# Altium project S7CAS-PLEIADES-CARTE-MERE_P01.PrjPcb (part 1 of 4)
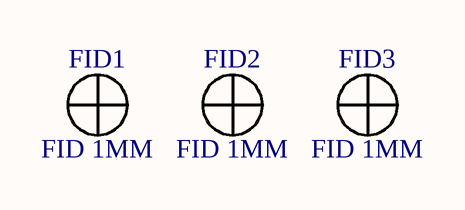
[diagram p0: S7CAS-PLEIADES-CARTE-MERE_P01_TITLE.SchDoc]
Project_Revision: 1.00; Project_Name: S7CAS-PLEIADES-CARTE-MERE; Project_Group: 01; Project_Global: Pleiades; Project_Designer3: Rejean Fontaine; Project_Designer2: Mathys Plante (PLAM1001); Project_Designer1: Mathieu Desautels (DESM1210); Project_Date: 13/01/2026
17 sheets, 430 parts. Net scope: flat (ports and power ports of the same name join across sheets).
Board file: S7CAS-PLEIADES-CARTE-MERE_P01.PcbDoc
Sheets:
  S7CAS-PLEIADES-CARTE-MERE_P01_TITLE.SchDoc
  S7CAS-PLEIADES-CARTE-MERE_P01_POWER.SchDoc
  S7CAS-PLEIADES-CARTE-MERE_P01_ALIM.SchDoc
  S7CAS-PLEIADES-CARTE-MERE_P01_CLOCK.SchDoc
  S7CAS-PLEIADES-CARTE-MERE_P01_ETHERNET.SchDoc
  S7CAS-PLEIADES-CARTE-MERE_P01_CNA.SchDoc
  S7CAS-PLEIADES-CARTE-MERE_P01_CAN.SchDoc
  S7CAS-PLEIADES-CARTE-MERE_P01_DDR3.SchDoc
  S7CAS-PLEIADES-CARTE-MERE_P01_MOTORS.SchDoc
  S7CAS-PLEIADES-CARTE-MERE_P01_IO.SchDoc
  S7CAS-PLEIADES-CARTE-MERE_P01_FPGA-BANK0.SchDoc
  S7CAS-PLEIADES-CARTE-MERE_P01_FPGA-BANK1.SchDoc
  S7CAS-PLEIADES-CARTE-MERE_P01_FPGA-BANK2.SchDoc
  S7CAS-PLEIADES-CARTE-MERE_P01_FPGA-BANK3.SchDoc
  S7CAS-PLEIADES-CARTE-MERE_P01_FPGA-BANK4.SchDoc
  S7CAS-PLEIADES-CARTE-MERE_P01_FPGA-BANK5.SchDoc
  S7CAS-PLEIADES-CARTE-MERE_P01_FPGA-ALIM.SchDoc

## Sheet S7CAS-PLEIADES-CARTE-MERE_P01_TITLE.SchDoc
size Tabloid; DocumentNumber: 1; SheetNumber: 1; SheetTotal: 17; Sheet_Name: Insert name in Document Parameters; Size: 11x17

### Parts
FID1  FID 1MM  [FID_CIRCLE_1MM]
FID2  FID 1MM  [FID_CIRCLE_1MM]
FID3  FID 1MM  [FID_CIRCLE_1MM]

### Nets

Not connected (* = marked no-connect by the designer): FID1 1 2; FID2 1 2; FID3 1 2

### Notes on the sheet
- Revision history
- Package size conversion
- Metric
- 1005
- 1608
- Imperial
- 0402
- 0603
- Revision
- 2012
- 3216
- 0805
- 1206
- 3225
- 6432
- 1210
- 2512
- Date :
- Project Title
- Global Project
- Size
- Group
- Date
- Sheet
- of
- Filename
- Designers

### Library data of the parts
FID1-FID3 = FID_CIRCLE_1MM: FID - FIDUCIAL 1MM CIRCLE DOUBLE-SIDED - 1MM; GRAMS Lib Spec: 2.8; Magnetic Material: NO; Cryo: UNKNOWN; Value: *; Tolerance: *; Voltage Rating: *; Current Rating: *; Power Max: *; HelpURL: https://www.pcb-3d.com/wordpress/wp-content/uploads/ipc-sm-782a_amendment_1_and_2.pdf; CreatedBy/Date: Jonathan Bouchard 2018-07-23; VerifiedBy: Caroline Paulin - 25 juillet 2018; Temperature: *; Package: 1MM CIRCLE; Manufacturer #1: *; Manufacturer #2: *; Part Number #2: *; Part Number #1: *; Polarized: *; Supplier 1: *; Supplier Part Number 1: *

## Sheet S7CAS-PLEIADES-CARTE-MERE_P01_POWER.SchDoc
size Tabloid; DocumentNumber: 2; SheetNumber: 2; SheetTotal: 17; Sheet_Name: POWER TREE; Size: 11x17

### Notes on the sheet
- Sheet Name
- Project Title
- Global Project
- Size
- Group
- Revision
- Date
- Sheet
- of
- Filename
- Designers
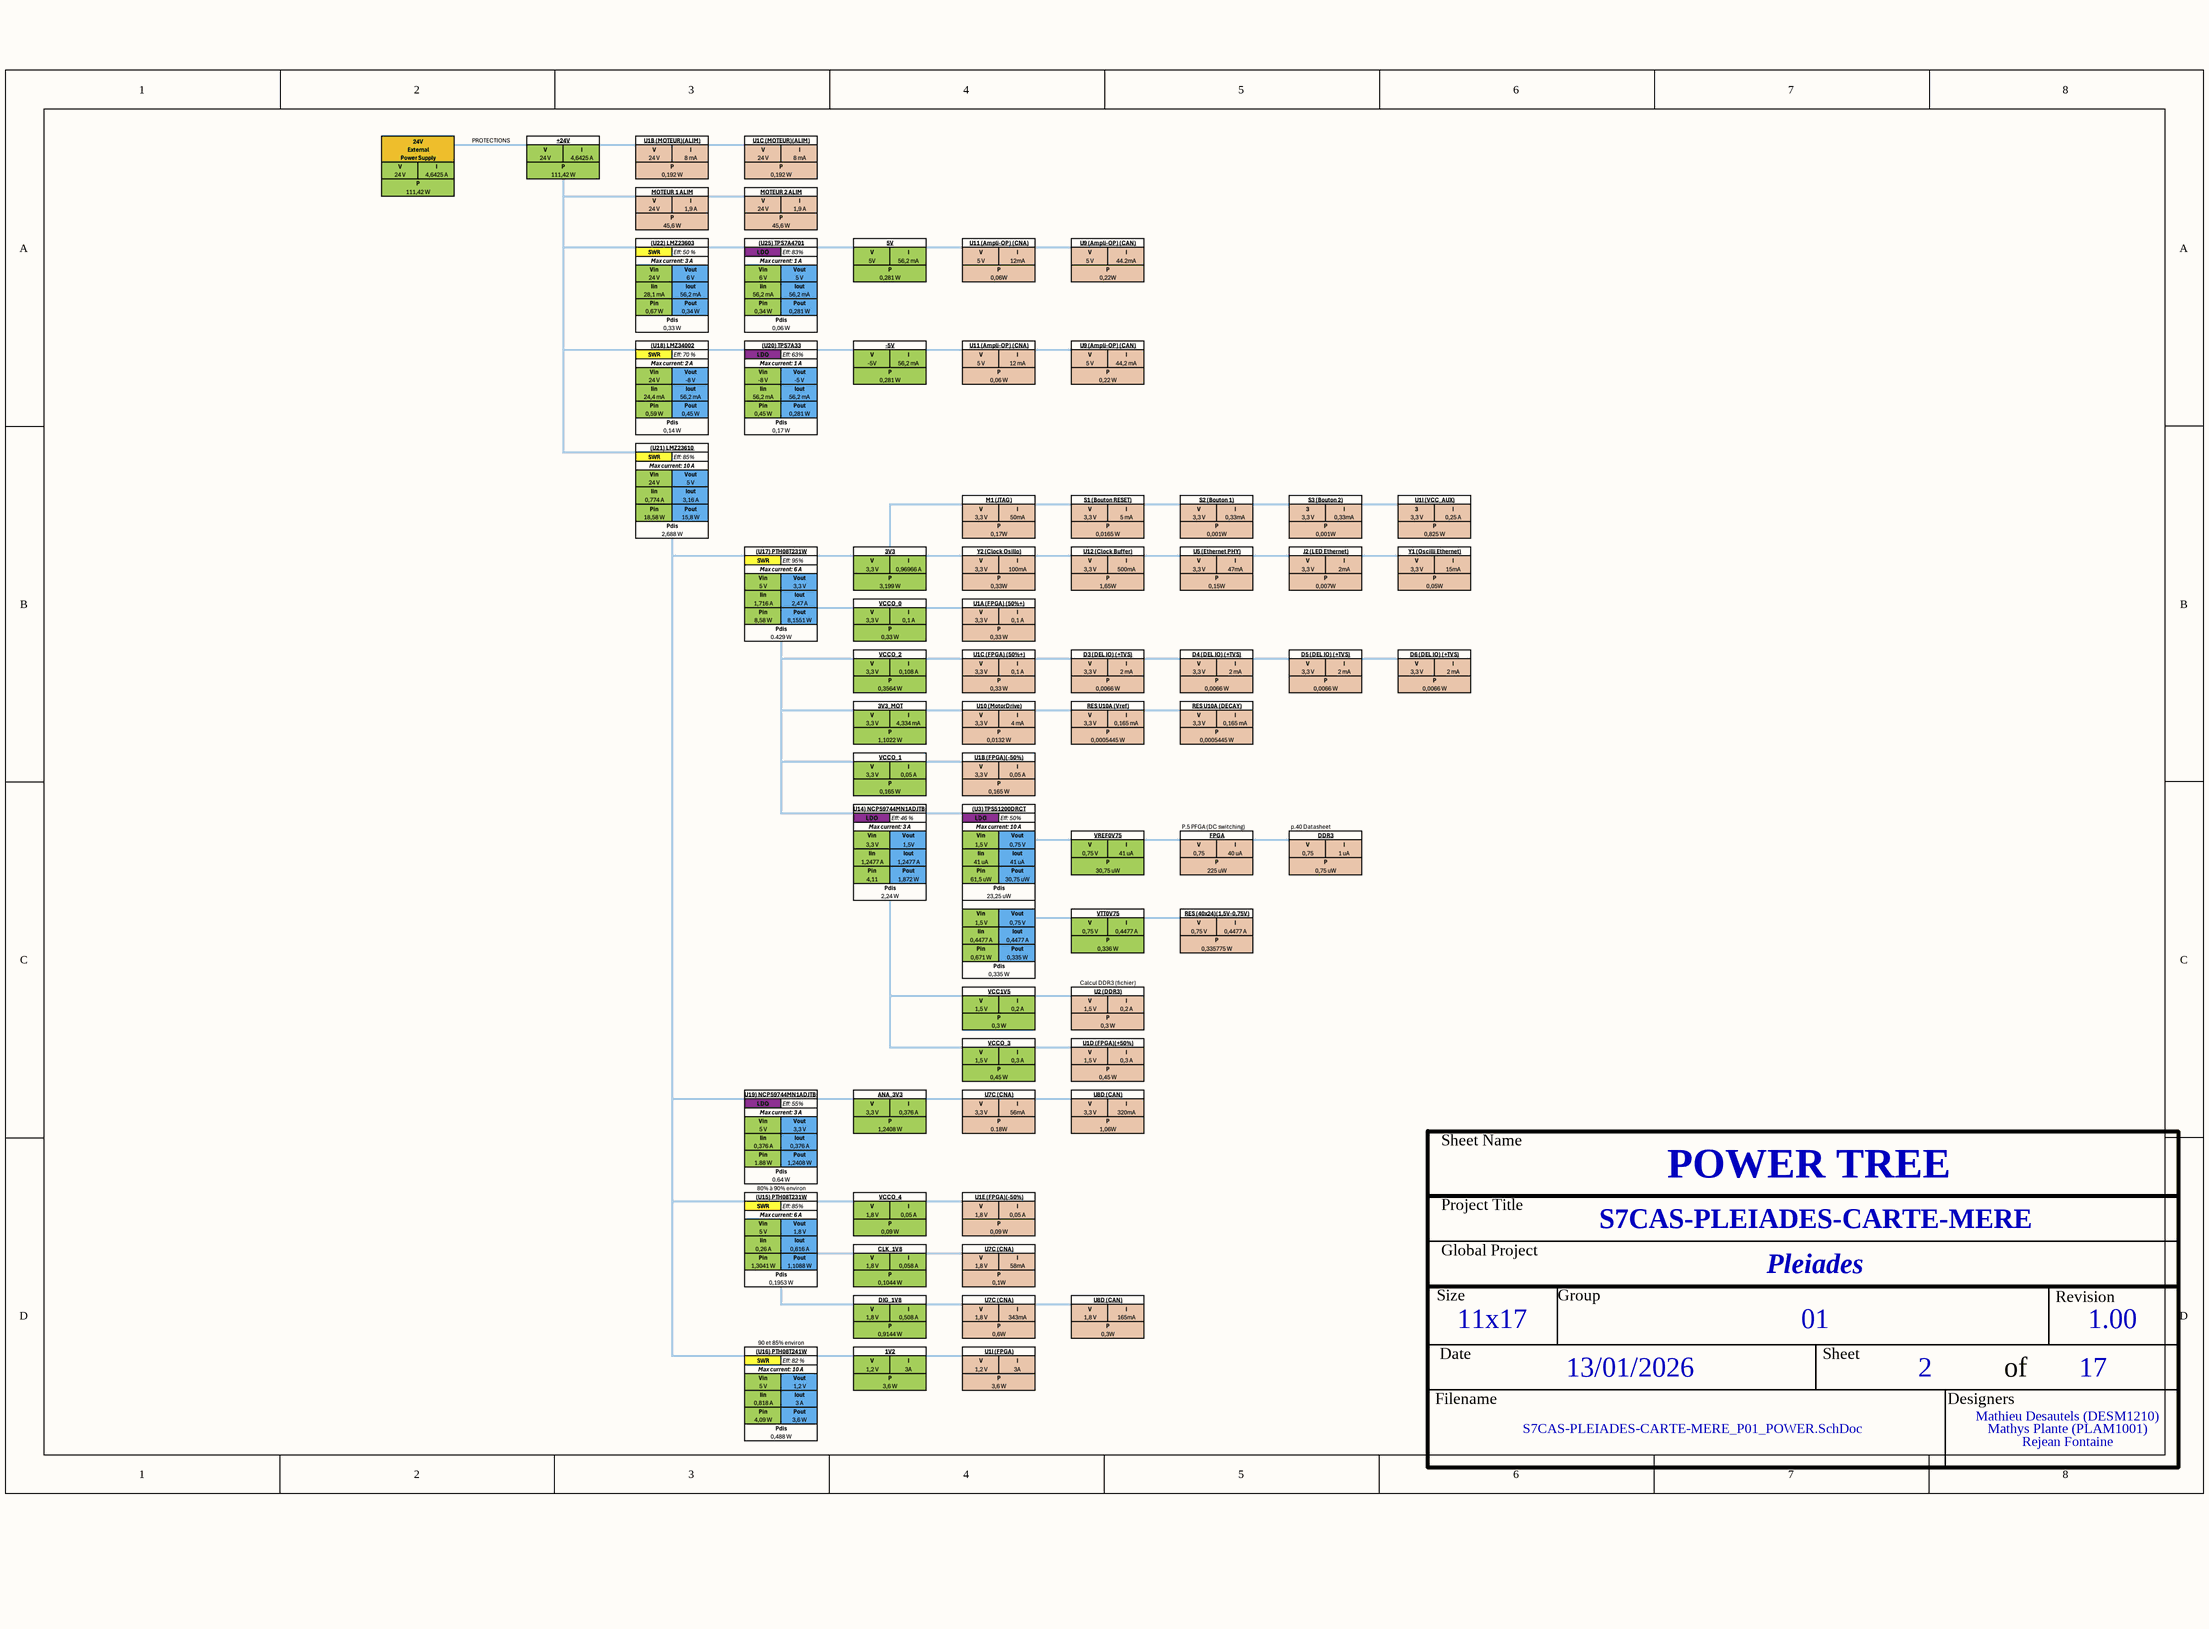
[diagram p1: S7CAS-PLEIADES-CARTE-MERE_P01_POWER.SchDoc]

## Sheet S7CAS-PLEIADES-CARTE-MERE_P01_ALIM.SchDoc
size Tabloid; DocumentNumber: 3; SheetNumber: 3; SheetTotal: 17; Sheet_Name: ALIM; Size: 11x17
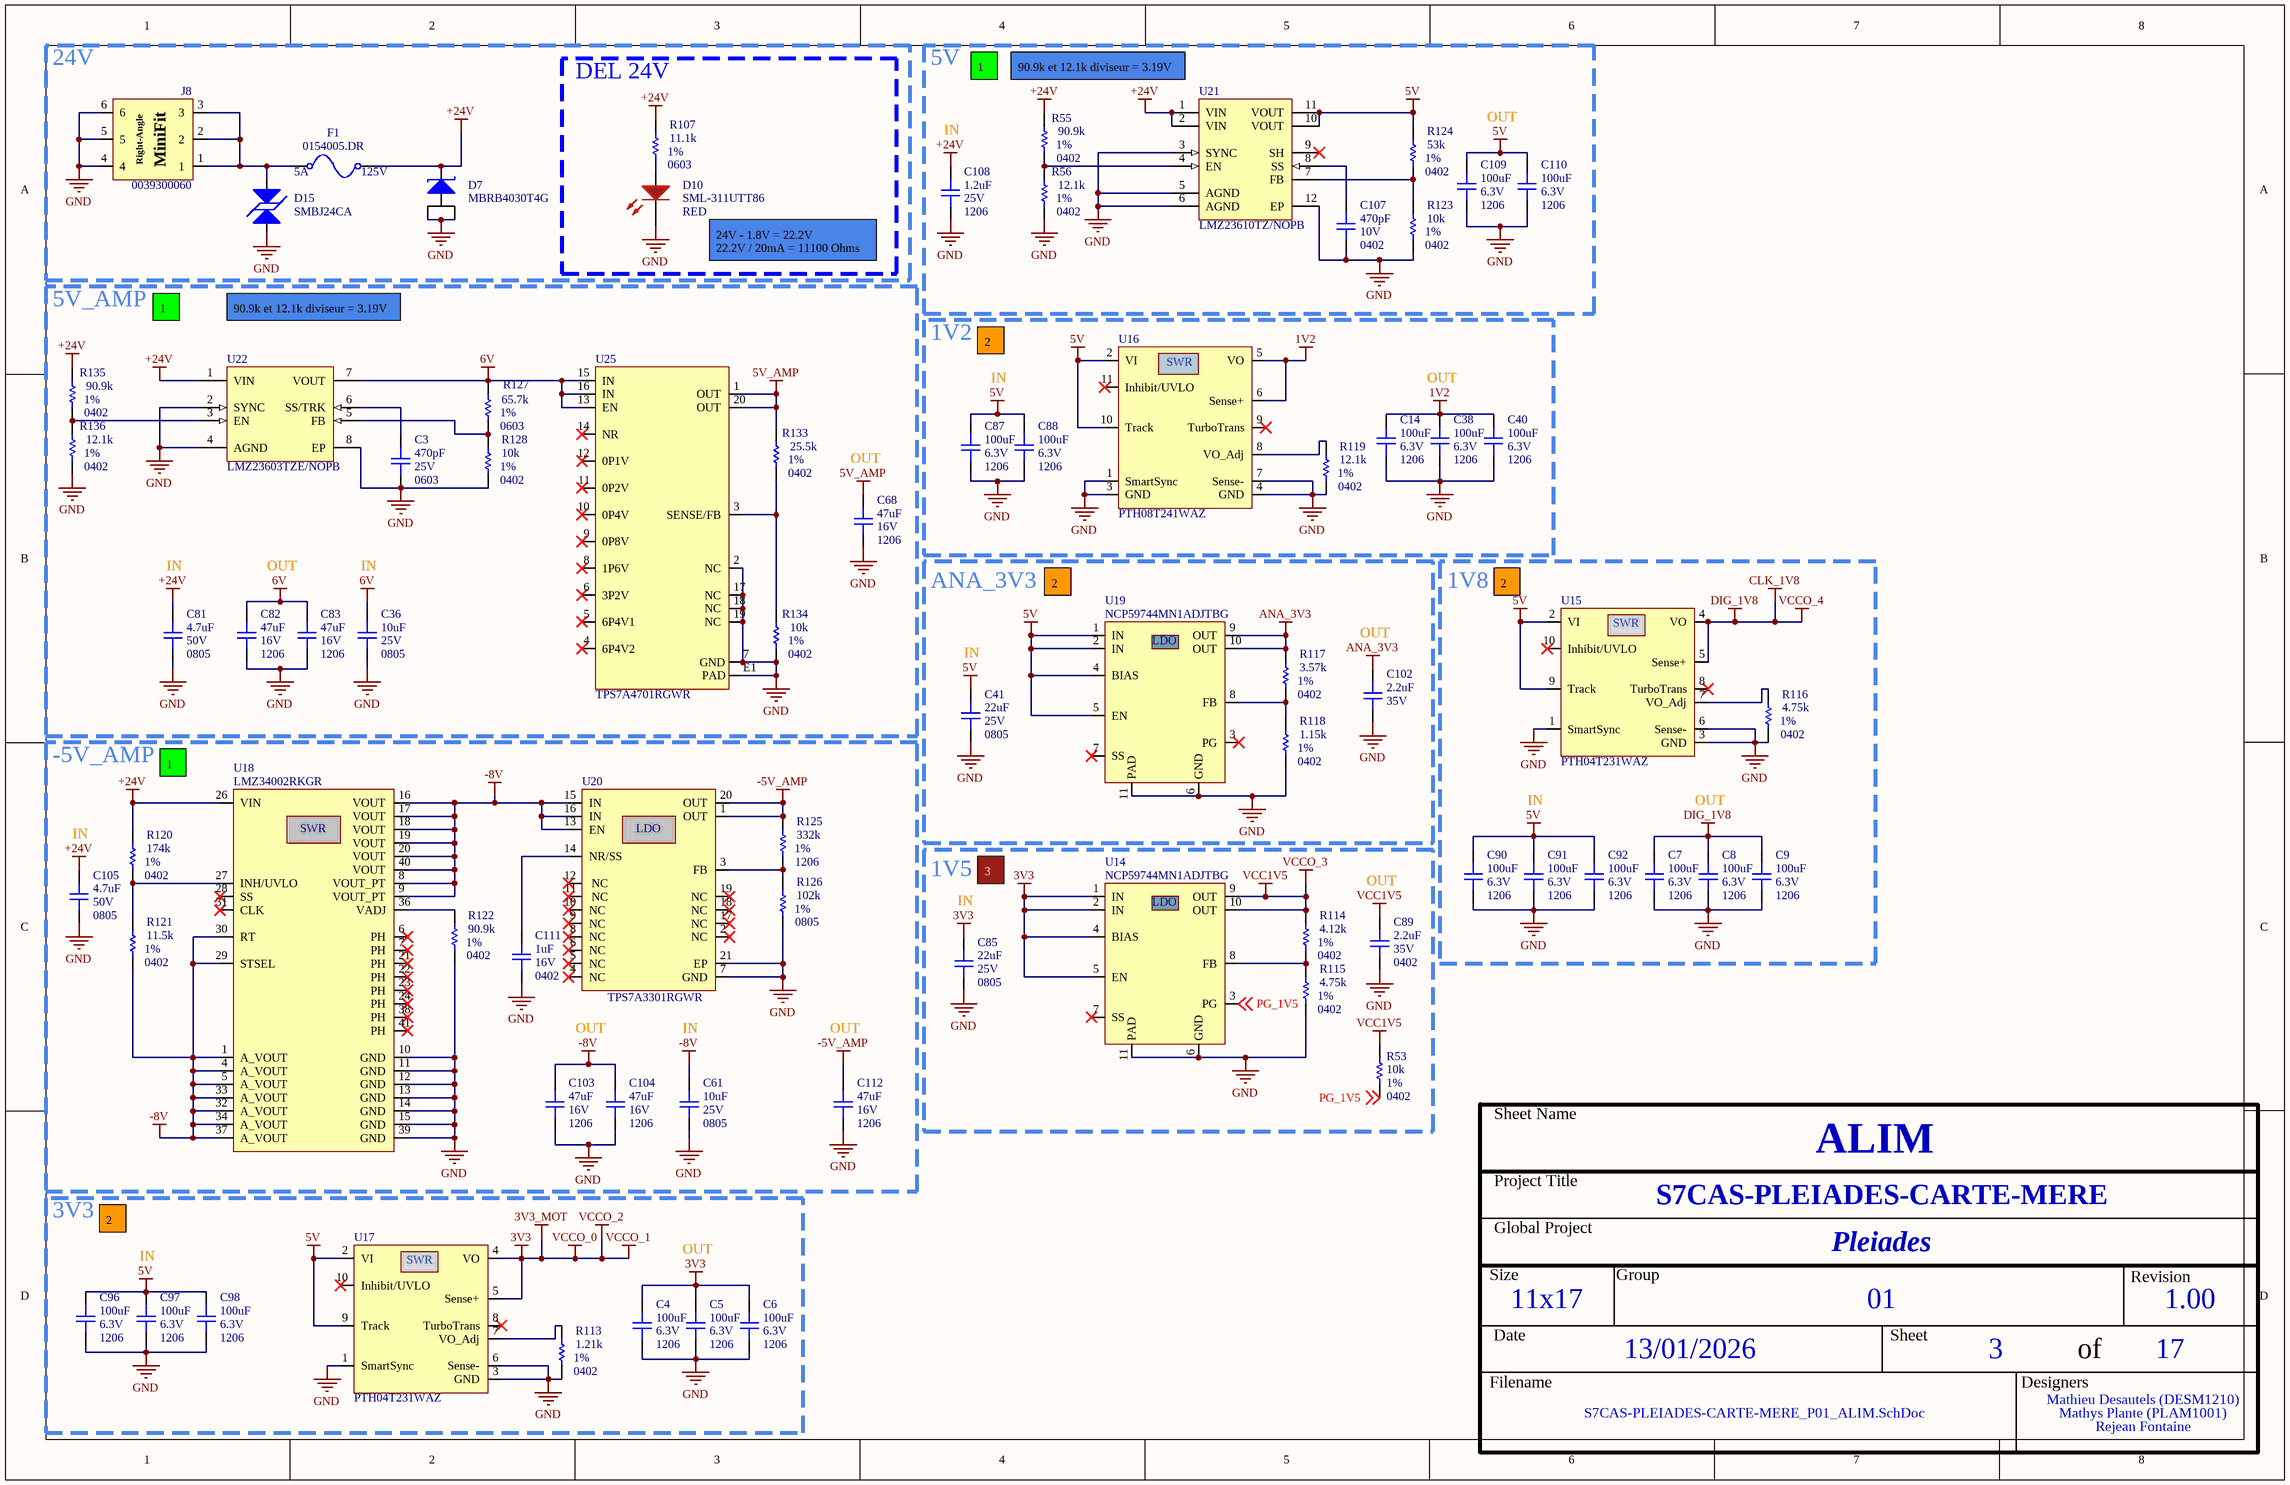
[diagram p2: S7CAS-PLEIADES-CARTE-MERE_P01_ALIM.SchDoc]

### Parts
C3  value 470pF  Voltage: 25V  Package: 0603  [CAP_0603]  (hidden comment: CAP - 0603)
C4  value 100uF  Voltage: 6.3V  Package: 1206  [CAP_1206]  (hidden comment: CAP - 1206)
C5  value 100uF  Voltage: 6.3V  Package: 1206  [CAP_1206]  (hidden comment: CAP - 1206)
C6  value 100uF  Voltage: 6.3V  Package: 1206  [CAP_1206]  (hidden comment: CAP - 1206)
C7  value 100uF  Voltage: 6.3V  Package: 1206  [CAP_1206]  (hidden comment: CAP - 1206)
C8  value 100uF  Voltage: 6.3V  Package: 1206  [CAP_1206]  (hidden comment: CAP - 1206)
C9  value 100uF  Voltage: 6.3V  Package: 1206  [CAP_1206]  (hidden comment: CAP - 1206)
C14  value 100uF  Voltage: 6.3V  Package: 1206  [CAP_1206]  (hidden comment: CAP - 1206)
C36  value 10uF  Voltage: 25V  Package: 0805  [CAP_0805]  (hidden comment: CAP - 0805)
C38  value 100uF  Voltage: 6.3V  Package: 1206  [CAP_1206]  (hidden comment: CAP - 1206)
C40  value 100uF  Voltage: 6.3V  Package: 1206  [CAP_1206]  (hidden comment: CAP - 1206)
C41  value 22uF  Voltage: 25V  Package: 0805  [CAP_0805]  (hidden comment: CAP - 0805)
C61  value 10uF  Voltage: 25V  Package: 0805  [CAP_0805]  (hidden comment: CAP - 0805)
C68  value 47uF  Voltage: 16V  Package: 1206  [CAP_1206]  (hidden comment: CAP - 1206)
C81  value 4.7uF  Voltage: 50V  Package: 0805  [CAP_0805]  (hidden comment: CAP - 0805)
C82  value 47uF  Voltage: 16V  Package: 1206  [CAP_1206]  (hidden comment: CAP - 1206)
C83  value 47uF  Voltage: 16V  Package: 1206  [CAP_1206]  (hidden comment: CAP - 1206)
C85  value 22uF  Voltage: 25V  Package: 0805  [CAP_0805]  (hidden comment: CAP - 0805)
C87  value 100uF  Voltage: 6.3V  Package: 1206  [CAP_1206]  (hidden comment: CAP - 1206)
C88  value 100uF  Voltage: 6.3V  Package: 1206  [CAP_1206]  (hidden comment: CAP - 1206)
C89  value 2.2uF  Voltage: 35V  Package: 0402  [CAP_0402]  (hidden comment: CAP - 0402)
C90  value 100uF  Voltage: 6.3V  Package: 1206  [CAP_1206]  (hidden comment: CAP - 1206)
C91  value 100uF  Voltage: 6.3V  Package: 1206  [CAP_1206]  (hidden comment: CAP - 1206)
C92  value 100uF  Voltage: 6.3V  Package: 1206  [CAP_1206]  (hidden comment: CAP - 1206)
C96  value 100uF  Voltage: 6.3V  Package: 1206  [CAP_1206]  (hidden comment: CAP - 1206)
C97  value 100uF  Voltage: 6.3V  Package: 1206  [CAP_1206]  (hidden comment: CAP - 1206)
C98  value 100uF  Voltage: 6.3V  Package: 1206  [CAP_1206]  (hidden comment: CAP - 1206)
C102  value 2.2uF  Voltage: 35V  [CAP_0402]  (hidden comment: CAP - 0402)
C103  value 47uF  Voltage: 16V  Package: 1206  [CAP_1206]  (hidden comment: CAP - 1206)
C104  value 47uF  Voltage: 16V  Package: 1206  [CAP_1206]  (hidden comment: CAP - 1206)
C105  value 4.7uF  Voltage: 50V  Package: 0805  [CAP_0805]  (hidden comment: CAP - 0805)
C107  value 470pF  Voltage: 10V  Package: 0402  [CAP_0402]  (hidden comment: CAP - 0402)
C108  value 1.2uF  Voltage: 25V  Package: 1206  [CAP_1206]  (hidden comment: CAP - 1206)
C109  value 100uF  Voltage: 6.3V  Package: 1206  [CAP_1206]  (hidden comment: CAP - 1206)
C110  value 100uF  Voltage: 6.3V  Package: 1206  [CAP_1206]  (hidden comment: CAP - 1206)
C111  value 1uF  Voltage: 16V  Package: 0402  [CAP_0402]  (hidden comment: CAP - 0402)
C112  value 47uF  Voltage: 16V  Package: 1206  [CAP_1206]  (hidden comment: CAP - 1206)
D7  MBRB4030T4G  [DIO_SCHOTTKY_MBRB4030T4G]
D10  SML-311UTT86  value RED  [LED_0603]
D15  SMBJ24CA  [TVS_PWR_SMBJ36CA]
F1  0154005.DR  Voltage Rating: 125V  Current Rating: 5A  [FUS_0154XXX.DR]
J8  0039300060  [CON_MINIFIT_0039300060]
R53  value 10k  Package: 0402  Precision: 1%  [RES_0402]  (hidden comment: RES - 0402)
R55  value 90.9k  Package: 0402  Precision: 1%  [RES_0402]  (hidden comment: RES - 0402)
R56  value 12.1k  Package: 0402  Precision: 1%  [RES_0402]  (hidden comment: RES - 0402)
R107  value 11.1k  Package: 0603  Precision: 1%  [RES_0603]  (hidden comment: RES - 0603)
R113  value 1.21k  Package: 0402  Precision: 1%  [RES_0402]  (hidden comment: RES - 0402)
R114  value 4.12k  Package: 0402  Precision: 1%  [RES_0402]  (hidden comment: RES - 0402)
R115  value 4.75k  Package: 0402  Precision: 1%  [RES_0402]  (hidden comment: RES - 0402)
R116  value 4.75k  Package: 0402  Precision: 1%  [RES_0402]  (hidden comment: RES - 0402)
R117  value 3.57k  Package: 0402  Precision: 1%  [RES_0402]  (hidden comment: RES - 0402)
R118  value 1.15k  Package: 0402  Precision: 1%  [RES_0402]  (hidden comment: RES - 0402)
R119  value 12.1k  Package: 0402  Precision: 1%  [RES_0402]  (hidden comment: RES - 0402)
R120  value 174k  Package: 0402  Precision: 1%  [RES_0402]  (hidden comment: RES - 0402)
R121  value 11.5k  Package: 0402  Precision: 1%  [RES_0402]  (hidden comment: RES - 0402)
R122  value 90.9k  Package: 0402  Precision: 1%  [RES_0402]  (hidden comment: RES - 0402)
R123  value 10k  Package: 0402  Precision: 1%  [RES_0402]  (hidden comment: RES - 0402)
R124  value 53k  Package: 0402  Precision: 1%  [RES_0402]  (hidden comment: RES - 0402)
R125  value 332k  Package: 1206  Precision: 1%  [RES_1206]  (hidden comment: RES - 1206)
R126  value 102k  Package: 0805  Precision: 1%  [RES_0805]  (hidden comment: RES - 0805)
R127  value 65.7k  Package: 0603  Precision: 1%  [RES_0603]  (hidden comment: RES - 0603)
R128  value 10k  Package: 0402  Precision: 1%  [RES_0402]  (hidden comment: RES - 0402)
R133  value 25.5k  Package: 0402  Precision: 1%  [RES_0402]  (hidden comment: RES - 0402)
R134  value 10k  Package: 0402  Precision: 1%  [RES_0402]  (hidden comment: RES - 0402)
R135  value 90.9k  Package: 0402  Precision: 1%  [RES_0402]  (hidden comment: RES - 0402)
R136  value 12.1k  Package: 0402  Precision: 1%  [RES_0402]  (hidden comment: RES - 0402)
U14  NCP59744MN1ADJTBG  [REG_LDO_NCP59744MN1ADJTBG]
U15  PTH04T231WAZ  [REG_SWR_PTH04T231WAZ]
U16  PTH08T241WAZ  [REG_SWR_PTH08T241WAZ]
U17  PTH04T231WAZ  [REG_SWR_PTH04T231WAZ]
U18  LMZ34002RKGR  [REG_SWR_LMZ34002RKGR]
U19  NCP59744MN1ADJTBG  [REG_LDO_NCP59744MN1ADJTBG]
U20  TPS7A3301RGWR  [REG_LDO_TPS7A3301RGWR]
U21  LMZ23610TZ/NOPB  [NDY0011A_M]
U22  LMZ23603TZE/NOPB  [NDW0007A_V]
U25  TPS7A4701RGWR  [REG_TPS7A4701RGWR]

### Blocks framed on the sheet
24V: D7 D15 F1 J8
5V: C107-C110 R55 R56 R123 R124 U21
DEL 24V: D10 R107
5V_AMP: C3 C36 C68 C81-C83 R127 R128 R133-R136 U22 U25
1V2: C14 C38 C40 C87 C88 R119 U16
ANA_3V3: C41 C102 R117 R118 U19
1V8: C7-C9 C90-C92 R116 U15
-5V_AMP: C61 C103-C105 C111 C112 R120-R122 R125 R126 U18 U20
1V5: C85 C89 R53 R114 R115 U14
3V3: C4-C6 C96-C98 R113 U17

### Nets
1V2: C14.2 C38.2 C40.2 U16.5(VO) U16.6(Sense+)
3V3: C4.2 C5.2 C6.2 C85.2 U14.1(IN) U14.2(IN) U14.4(BIAS) U14.5(EN) U17.4(VO) U17.5(Sense+)  [also labelled 3V3_MOT, VCCO_0, VCCO_1, VCCO_2]  [project net VDD_3V3]
5V: C41.2 C87.2 C88.2 C90.2 C91.2 C92.2 C96.2 C97.2 C98.2 C109.2 C110.2 R124.2 U15.2(VI) U15.9(Track) U16.2(VI) U16.10(Track) U17.2(VI) U17.9(Track) U19.1(IN) U19.2(IN) U19.4(BIAS) U19.5(EN) U21.10(VOUT) U21.11(VOUT)
5V_AMP: C68.2 R133.2 U25.1(OUT) U25.20(OUT)
6V: C36.2 C82.2 C83.2 R127.2 U22.7(VOUT) U25.13(EN) U25.15(IN) U25.16(IN)
+24V: C81.2 C105.2 C108.2 D7.4 F1.2 R55.2 R107.2 R120.2 R135.2 U18.26(VIN) U21.1(VIN) U21.2(VIN) U22.1(VIN)
-5V_AMP: C112.2 R125.2 U20.1(OUT) U20.20(OUT)
-8V: C61.2 C103.2 C104.2 R121.1 U18.1(A_VOUT) U18.4(A_VOUT) U18.5(A_VOUT) U18.8(VOUT_PT) U18.9(VOUT_PT) U18.16(VOUT) U18.17(VOUT) U18.18(VOUT) U18.19(VOUT) U18.20(VOUT) U18.29(STSEL) U18.30(RT) U18.32(A_VOUT) U18.33(A_VOUT) U18.34(A_VOUT) U18.37(A_VOUT) U18.40(VOUT) U20.13(EN) U20.15(IN) U20.16(IN)
ANA_3V3: C102.2 R117.2 U19.9(OUT) U19.10(OUT)
CLK_1V8: C7.2 C8.2 C9.2 U15.4(VO) U15.5(Sense+)  [also labelled DIG_1V8, VCCO_4]
GND: C3.1 C4.1 C5.1 C6.1 C7.1 C8.1 C9.1 C14.1 C36.1 C38.1 C40.1 C41.1 C61.1 C68.1 C81.1 C82.1 C83.1 C85.1 C87.1 C88.1 C89.1 C90.1 C91.1 C92.1 C96.1 C97.1 C98.1 C102.1 C103.1 C104.1 C105.1 C107.1 C108.1 C109.1 C110.1 C111.1 C112.1 D7.1(A) D7.3 D10.K D15.2 J8.4 J8.5 J8.6 R56.1 R113.1 R115.1 R116.1 R118.1 R119.1 R122.1 R123.1 R126.1 R128.1 R134.1 R136.1 U14.6(GND) U14.11(PAD) U15.1(SmartSync) U15.3(GND) U15.6(Sense-) U16.1(SmartSync) U16.3(GND) U16.4(GND) U16.7(Sense-) U17.1(SmartSync) U17.3(GND) U17.6(Sense-) U18.10(GND) U18.11(GND) U18.12(GND) U18.13(GND) U18.14(GND) U18.15(GND) U18.39(GND) U19.6(GND) U19.11(PAD) U20.7(GND) U20.21(EP) U21.3(SYNC) U21.5(AGND) U21.6(AGND) U21.12(EP) U22.2(SYNC) U22.4(AGND) U22.8(EP) U25.2(NC) U25.7(GND) U25.17(NC) U25.18(NC) U25.19(NC) U25.E1(PAD)
VCC1V5: C89.2 R53.2 R114.2 U14.9(OUT) U14.10(OUT)  [also labelled VCCO_3]
PG_1V5: R53.1 U14.3(PG) ; off-sheet PG_1V5
NetC3_2: C3.2 U22.6(SS/TRK)
NetC107_2: C107.2 U21.8(SS)
NetC111_2: C111.2 U20.14(NR/SS)
NetD10_A: D10.A R107.1
NetD15_1: D15.1 F1.1 J8.1 J8.2 J8.3
NetR55_1: R55.1 R56.2 U21.4(EN)
NetR113_2: R113.2 U17.7(VO_Adj)
NetR114_1: R114.1 R115.2 U14.8(FB)
NetR116_2: R116.2 U15.7(VO_Adj)
NetR117_1: R117.1 R118.2 U19.8(FB)
NetR119_2: R119.2 U16.8(VO_Adj)
NetR120_1: R120.1 R121.2 U18.27(INH/UVLO)
NetR122_2: R122.2 U18.36(VADJ)
NetR123_2: R123.2 R124.1 U21.7(FB)
NetR125_1: R125.1 R126.2 U20.3(FB)
NetR127_1: R127.1 R128.2 U22.5(FB)
NetR133_1: R133.1 R134.2 U25.3(SENSE/FB)
NetR135_1: R135.1 R136.2 U22.3(EN)

Not connected (* = marked no-connect by the designer): U14 7(SS)*; U15 8(TurboTrans)* 10(Inhibit/UVLO)*; U16 9(TurboTrans)* 11(Inhibit/UVLO)*; U17 8(TurboTrans)* 10(Inhibit/UVLO)*; U18 2(DNC) 3(DNC) 6(PH)* 7(PH)* 21(PH)* 22(PH)* 23(PH)* 24(PH)* 25(DNC) 28(SS)* 31(CLK)* 35(DNC) 38(PH)* 41(PH)*; U19 3(PG)* 7(SS)*; U20 2(NC)* 4(NC)* 5(NC)* 6(NC)* 8(NC)* 9(NC)* 10(NC)* 11(NC)* 12(NC)* 17(NC)* 18(NC)* 19(NC)*; U21 9(SH)*; U25 4(6P4V2)* 5(6P4V1)* 6(3P2V)* 8(1P6V)* 9(0P8V)* 10(0P4V)* 11(0P2V)* 12(0P1V)* 14(NR)*

### Notes on the sheet
- 1
- 90.9k et 12.1k diviseur = 3.19V
- (near C108) IN
- OUT
- 24V - 1.8V = 22.2V
  22.2V / 20mA = 11100 Ohms
- 2
- IN
- (near C68) OUT
- (near C81) IN
- (near U19) 2
- (near U15) 2
- (near C41) IN
- (near C102) OUT
- 3
- (near C89) OUT
- (near C85) IN
- (near C97) IN
- Sheet Name
- Project Title
- Global Project
- Size
- Group
- Revision
- Date
- Sheet
- of
- Filename
- Designers
- (in symbol CON_MINIFIT_0039300060) Right-Angle; MiniFit
- (in symbol REG_LDO_NCP59744MN1ADJTBG) LDO
- (in symbol REG_LDO_TPS7A3301RGWR) LDO
- (in symbol REG_SWR_LMZ34002RKGR) SWR
- (in symbol REG_SWR_PTH04T231WAZ) SWR
- (in symbol REG_SWR_PTH08T241WAZ) SWR

### Library data of the parts
C3 = CAP - 0603: CAP - 0603 - 470pF; Precision: 10%; Current: *; CreatedBy: Jonathan Bouchard; Power: *
C4-C9 C14 C38 C40 C87 C88 C90-C92 C96-C98 C109 C110 = CAP - 1206: 100 µF ±20% 6.3V Ceramic Capacitor X6T 1206 (3216 Metric); Mfg Part Number: GRM31CD80J107MEA8K; Mfg: Murata Electronics; Current: *; CreatedBy: Jonathan Bouchard; Power: *; Precision: 20%
C36 C61 = CAP - 0805: 10 µF ±10% 25V Ceramic Capacitor X5R 0805 (2012 Metric); Mfg Part Number: CL21A106KAYNNNE; Mfg: Samsung Electro-Mechanics; Current: *; CreatedBy: Jonathan Bouchard; Power: *; Precision: 10%; Part Number #1: CL21A106KAYNNNE
C41 C85 = CAP - 0805: 22 µF ±20% 25V Ceramic Capacitor X5R 0805 (2012 Metric); Mfg Part Number: CL21A226MAYNNNE; Mfg: Samsung Electro-Mechanics; Current: *; CreatedBy: Jonathan Bouchard; Power: *; Precision: 20%
C68 C82 C83 C103 C104 C112 = CAP - 1206: 47 µF ±20% 16V Ceramic Capacitor X5R 1206 (3216 Metric); Mfg Part Number: EMK316BBJ476ML-T; Mfg: Taiyo Yuden; Current: *; CreatedBy: Jonathan Bouchard; Power: *; Precision: 20%
C81 C105 = CAP - 0805: 4.7 µF ±10% 50V Ceramic Capacitor X5R 0805 (2012 Metric); Mfg Part Number: GRT21BR61H475KE13L; Mfg: Murata Electronics; Current: *; CreatedBy: Jonathan Bouchard; Power: *; Precision: 10%
C89 C102 = CAP - 0402: 2.2 µF ±10% 35V Ceramic Capacitor X5R 0402 (1005 Metric); Mfg Part Number: GRM155R6YA225KE11D; Part Number #1: CL05A225KP5NSNC; Mfg: Murata Electronics; Current: *; CreatedBy: Jonathan Bouchard; Power: *; Precision: 10%
  C102: Package: 0402
C107 = CAP - 0402: Mfg Part Number: C0402C471K8RACAUTO; Precision: 10%; Current: *; CreatedBy: Jonathan Bouchard; Power: *
C108 = CAP - 1206: 1.2 µF ±10% 25V Ceramic Capacitor X7R 1206 (3216 Metric); Mfg Part Number: C1206C125K3RACTU; Mfg: KEMET; Current: *; CreatedBy: Jonathan Bouchard; Power: *; Precision: 10%
C111 = CAP - 0402: 1 µF ±10% 16V Ceramic Capacitor X5R 0402 (1005 Metric); Mfg Part Number: CL05A105KO5NNNC; Mfg: Samsung Electro-Mechanics; Current: *; CreatedBy: Jonathan Bouchard; Power: *; Precision: 10%
D7 = DIO_SCHOTTKY_MBRB4030T4G: DIO - 30V MAX 40 A - TO-263-3; Manufacturer #1: ON Semiconductor; Value: Vf = 550mV @ 40A; Current Rating: 40A; GRAMS Lib Spec: 2.8; Magnetic Material: NO; Polarized: Yes; Cryo: UNKNOWN; Tolerance: *; Voltage Rating: 30V; Power Max: *; HelpURL: http://www.onsemi.com/pub/Collateral/MBRB4030-D.PDF; CreatedBy/Date: Arnaud Samson - 06/07/18; VerifiedBy: Jonathan Bouchard 2018-07-12; Temperature: -65°C ~ 175°C; Package: D2PAK; Manufacturer #2: *; Part Number #2: *; Part Number #1: MBRB4030T4G; Supplier 1: Digi-Key; Supplier Part Number 1: MBRB4030T4GOSCT-ND; Mfg Part Number: MBRB4030T4G
D10 = LED_SML-311UTT86: LED - 620nM RED 2mA - 0603; Voltage: 1.8V; Mfg: ROHM Semiconductor; Power: 44mW; Current: 2mA; HelpURL: http://media.digikey.com/pdf/Data%20Sheets/Rohm%20PDFs/SML-311%20Series.pdf; CreatedBy: Jonathan Bouchard; Temperature: -30°C to 85°C; Package: 0603; Precision: *; Mfg Part Number: SML-311UTT86; Supplier 1: Digikey; Supplier Part Number 1: 511-1304-1-ND
D15 = TVS_PWR_SMBJ24CA: TVS - 24V 26.7V 600W - DO214AA; Manufacturer #1: Littelfuse Inc.; Value: Vbr = 26.7V -  Clamp = 38.9V; Voltage Rating: 24V Standoff; Current Rating: 15.5A; GRAMS Lib Spec: 2.8; Magnetic Material: UNKNOWN; Polarized: NO; Tolerance: *; Power Max: 600W; HelpURL: http://www.littelfuse.com/~/media/electronics/datasheets/tvs_diodes/littelfuse_tvs_diode_smbj_datasheet.pdf.pdf; CreatedBy/Date: Arnaud Samson - 06/07/18; VerifiedBy: Jonathan Bouchard - 2018-07-13; Temperature: -65°C ~ 150°C (TJ); Package: DO214AA; Manufacturer #2: *; Note: *; Assembly Type: SMD; Part Number #2: *; Part Number #1: SMBJ24CA; Supplier 1: Digi-Key; Supplier Part Number 1: SMBJ24CALFCT-ND; Cryo: UNKNOWN
F1 = FUS_0154005.DR: FUS - 5 A 125 VAC/VDC - 2-SMD; Manufacturer #1: Littelfuse Inc.; Value: 5A 125V AC/DC FAST; GRAMS Lib Spec: 2.8; Magnetic Material: UNKNOWN; Polarized: NO; Tolerance: *; Power Max: *; HelpURL: http://www.littelfuse.com/~/media/electronics/datasheets/fuses/littelfuse_fuse_154_154t_154l_154tl_datasheet.pdf.pdf; CreatedBy/Date: Arnaud Samson - 06/07/18; VerifiedBy: Jonathan Bouchard 2018-07-16; Temperature: -55°C ~ 125°C; Package: 2-SMD; Manufacturer #2: *; Part Number #2: *; Part Number #1: 0154005.DR; Supplier 1: Digi-Key; Supplier Part Number 1: F1228CT-ND; Cryo: UNKNOWN; Mfg Part Number: 0154005.DR
J8 = CON_MINIFIT_0039300060: CON - Mini-Fit Through Hole, Right Angle 6 position; Manufacturer #1: Molex; Current Rating: 8A; GRAMS Lib Spec: 2.8; Magnetic Material: Unknown; Polarized: Yes; Voltage Rating: 600V; CreatedBy/Date: Joel Lemay 2018-06-21; HelpURL: https://www.molex.com/pdm_docs/sd/039300060_sd.pdf; Manufacturer #2: *; Package: TH; Part Number #1: 0039300060; Part Number #2: *; Power Max: *; Supplier 1: Digi-Key; Supplier Part Number 1: WM21353-ND; Temperature: - 40°C to + 80°C; Tolerance: *; Value: *; VerifiedBy: Caroline Paulin - 10 sept 2018; Cryo: UNKNOWN; Mfg Part Number: 0039300060
R53 = RES - 0402: 10 kOhms ±1% 0.063W, 1/16W Chip Resistor 0402 (1005 Metric) Automotive AEC-Q200 Thick Film; Mfg Part Number: RMCF0402FT10K0; Voltage: 75V; Current: *; CreatedBy: Jonathan Bouchard; Power: 1/16W; Part Number #1: RMCF0402FT10K0
R55 R122 R135 = RES - 0402: 90.9 kOhms ±1% 0.063W, 1/16W Chip Resistor 0402 (1005 Metric) Moisture Resistant Thick Film; Mfg Part Number: RC0402FR-0790K9L; Voltage: 50V; Mfg: YAGEO; Current: *; CreatedBy: Jonathan Bouchard; Power: 1/16W
R56 R119 R136 = RES - 0402: 12.1 kOhms ±1% 0.063W, 1/16W Chip Resistor 0402 (1005 Metric) Moisture Resistant Thick Film; Mfg Part Number: RC0402FR-0712K1L; Voltage: 50V; Mfg: YAGEO; Current: *; CreatedBy: Jonathan Bouchard; Power: 1/16W
R107 = RES - 0603: 11.1 kOhms ±0.1% 0.167W, 1/6W Chip Resistor 0603 (1608 Metric) Automotive AEC-Q200 Thin Film; Mfg Part Number: RNCF0603BTE11K1; Mfg: Stackpole Electronics Inc; Current: *; CreatedBy: Jonathan Bouchard
R113 = RES - 0402: 1.21 kOhms ±1% 0.063W, 1/16W Chip Resistor 0402 (1005 Metric) Automotive AEC-Q200 Thick Film; Mfg Part Number: RMCF0402FT1K21; Voltage: 50V; Mfg: Stackpole Electronics Inc; Current: *; CreatedBy: Jonathan Bouchard; Power: 1/16W
R114 = RES - 0402: 4.12 kOhms ±0.1% 0.063W, 1/16W Chip Resistor 0402 (1005 Metric) Automotive AEC-Q200 Thin Film; Mfg Part Number: ERA-2AEB4121X; Voltage: 50V; Mfg: Panasonic Electronic Components; Current: *; CreatedBy: Jonathan Bouchard; Power: 1/16W
R115 R116 = RES - 0402: 4.75 kOhms ±0.1% 0.063W, 1/16W Chip Resistor 0402 (1005 Metric) Automotive AEC-Q200 Thin Film; Mfg Part Number: ERA-2AEB4751X; Voltage: 50V; Mfg: Panasonic Electronic Components; Current: *; CreatedBy: Jonathan Bouchard; Power: 1/16W
R117 = RES - 0402: 3.57 kOhms ±1% 0.063W, 1/16W Chip Resistor 0402 (1005 Metric) Moisture Resistant Thick Film; Mfg Part Number: RC0402FR-073K57L; Voltage: 50V; Mfg: YAGEO; Current: *; CreatedBy: Jonathan Bouchard; Power: 1/16W
R118 = RES - 0402: 1.15 kOhms ±1% 0.1W, 1/10W Chip Resistor 0603 (1608 Metric) Automotive AEC-Q200 Thick Film; Mfg Part Number: ERJ-3EKF1151V; Voltage: 50V; Mfg: Panasonic Electronic Components; Power: 1/16W; Current: *; CreatedBy: Jonathan Bouchard
R120 = RES - 0402: 174 kOhms ±1% 0.063W, 1/16W Chip Resistor 0402 (1005 Metric) Moisture Resistant Thick Film; Mfg Part Number: RC0402FR-07174KL; Voltage: 50V; Mfg: YAGEO; Current: *; CreatedBy: Jonathan Bouchard; Power: 1/16W
R121 = RES - 0402: 11.5 kOhms ±1% 0.063W, 1/16W Chip Resistor 0402 (1005 Metric) Moisture Resistant Thick Film; Mfg Part Number: RC0402FR-0711K5L; Voltage: 50V; Mfg: YAGEO; Current: *; CreatedBy: Jonathan Bouchard; Power: 1/16W
R123 R128 R134 = RES - 0402: 10 kOhms ±1% 0.063W, 1/16W Chip Resistor 0402 (1005 Metric) Moisture Resistant Thick Film; Mfg Part Number: RC0402FR-0710KL; Voltage: 50V; Mfg: YAGEO; Current: *; CreatedBy: Jonathan Bouchard; Power: 1/16W
R124 = RES - 0402: 53 kOhms ±0.1% 0.063W, 1/16W Chip Resistor 0402 (1005 Metric) Thin Film; Mfg Part Number: RT0402BRD0753KL; Voltage: 50V; Mfg: YAGEO; Current: *; CreatedBy: Jonathan Bouchard; Power: 1/16W
R125 = RES - 1206: 332 kOhms ±0.1% 0.25W, 1/4W Chip Resistor 1206 (3216 Metric) Automotive AEC-Q200 Thin Film; Mfg Part Number: ERA-8AEB3323V; Mfg: Panasonic Electronic Components; Current: *; CreatedBy: Jonathan Bouchard
R126 = RES - 0805: 102 kOhms ±0.05% 0.125W, 1/8W Chip Resistor 0805 (2012 Metric) Anti-Sulfur, Automotive AEC-Q200, Moisture Resistant Thin Film; Mfg Part Number: TNPU0805102KAYEA00; Mfg: Vishay Dale; Current: *; CreatedBy: Jonathan Bouchard
R127 = RES - 0603: 65.7 kOhms ±0.5% 0.1W, 1/10W Chip Resistor 0603 (1608 Metric) Thin Film; Mfg Part Number: RT0603DRE0765K7L; Mfg: YAGEO; Current: *; CreatedBy: Jonathan Bouchard
R133 = RES - 0402: 25.5 kOhms ±0.1% 0.063W, 1/16W Chip Resistor 0402 (1005 Metric) Automotive AEC-Q200 Thin Film; Mfg Part Number: ERA-2AEB2552X; Voltage: 50V; Mfg: Panasonic Electronic Components; Current: *; CreatedBy: Jonathan Bouchard; Power: 1/16W
U14 U19 = REG_LDO_NCP59744MN1ADJTBG: REG - LINEAR POS ADJ 3A BIAS - 10-VFDFN; Manufacturer #1: ON Semiconductor; Value: 0.8V ~ 3.6V; Voltage Rating: (Vout+VDO) ~ 5.5V; Power Max: 10.8W; GRAMS Lib Spec: 2.8; Magnetic Material: Unknown; Polarized: Yes; Tolerance: -; Current Rating: 3A; HelpURL: https://www.onsemi.com/pub/Collateral/NCP59744-D.PDF; CreatedBy/Date: Raphael Bouchard / 2019-06-07; VerifiedBy: C.Paulin - 13/06/2019; Temperature: -40°C ~ 125°C (TJ); Package: 10-VFDFN; Manufacturer #2: -; Part Number #2: -; Part Number #1: NCP59744MN1ADJTBG; Supplier 1: Digi-Key; Supplier Part Number 1: NCP59744MN1ADJTBGOSCT-ND; Cryo: UNKNOWN; Mfg Part Number: NCP59744MN1ADJTBG
U15 U17 = REG_SWR_PTH04T231WAZ: REG - MODULE PIP 6A 2.2V/5.5V - 10SMD; Manufacturer #1: Texas Instruments; Current Rating: 6A (out); Value: 0.69 - 3.6V (Out); Voltage rating: 2.2-5.5V (Input); Polarized: Yes; Magnetic Material: UNKNOWN; Manufacturer #2: *; Power Max: *; Part Number #1: PTH04T231WAZ; Part Number #2: *; HelpURL: http://www.ti.com/lit/ds/symlink/pth04t231w.pdf; Supplier 1: Digi-Key; Temperature: -40°C ~ 85°C; Supplier Part Number 1: 296-21792-ND; Package: SMD; CreatedBy/Date: Olivier Bernard / 6/5/2018; VerifiedBy: Caroline Paulin / 10 juillet 2018; Cryo: UNKNOWN; Mfg Part Number: PTH04T231WAZ
U16 = REG_SWR_PTH08T241WAZ: REG - MODULE PIP 10A 14VIN - 11-SMD; Manufacturer #1: Texas Instruments; Current Rating: 10A (out); Voltage rating: 4.5-14V (Input), 0.69 - 5.5V (Out); Polarized: Yes; Magnetic Material: UNKNOWN; Manufacturer #2: *; Power Max: *; Value: *; Part Number #1: PTH08T241WAZ; Part Number #2: *; HelpURL: http://www.ti.com/lit/ds/symlink/pth08t241w.pdf; Supplier 1: Digi-Key; Supplier Part Number 1: 296-21339-ND; Temperature: -40°C ~ 85°C; Package: SMD; CreatedBy/Date: Olivier Bernard / 6/5/2018; VerifiedBy: Caroline Paulin / 10 juillet 2018; Cryo: UNKNOWN; Mfg Part Number: PTH08T241WAZ
U18 = REG_SWR_LMZ34002RKGR: REG - DC DC Converter -3V to -17V 2A - 41-B1QFN; Manufacturer #1: Texas Instruments; Value: -3 ~ -17V; Voltage Rating: 4.5-40V; Power Max: 15W; GRAMS Lib Spec: 2.8c; Magnetic Material: Unknown; Polarized: Yes; Tolerance: *; Current Rating: 2A; HelpURL: http://www.ti.com/lit/ds/symlink/lmz34002.pdf; CreatedBy/Date: P.Marcoux  20-06-2019; VerifiedBy: C.Paulin - 22/01/2020; Temperature: -40°C ~ 85°C; Package: 41-B1QFN; Manufacturer #2: *; Part Number #2: *; Part Number #1: LMZ34002RKGR; Supplier 1: Digi-Key; Supplier Part Number 1: 296-44356-1-ND; Cryo: UNKNOWN; Mfg Part Number: LMZ34002RKGR
U20 = REG_LDO_TPS7A3301RGWR: REG - LDO Negative Adjustable 1 Output -1.18V-33V 1A -  20-VQFN (5x5); Manufacturer #1: Texas Instruments; Value: -1.18V~-33V; Voltage Rating: -36V; GRAMS Lib Spec: 2.8; Magnetic Material: Unknown; Polarized: Yes; Tolerance: *; Current Rating: 1A; Power Max: *; HelpURL: http://www.ti.com/lit/ds/symlink/tps7a33.pdf; CreatedBy/Date: Keven Deslandes - 2018/10/11; VerifiedBy: Caroline Paulin - 11/12/2018; Temperature: -40°C ~ 125°C; Package: 20-VQFN; Manufacturer #2: *; Part Number #2: *; Part Number #1: TPS7A3301RGWR; Supplier 1: Digi-Key; Supplier Part Number 1: 296-39502-1-ND; Cryo: UNKNOWN; Mfg Part Number: TPS7A3301RGWR
U21 = CMP-0069-02067-2: 10A SIMPLE SWITCHER® Power Module with 36V Maximum Input Voltage and Current Sharing, 11 pin TO-PMOD, 32 Rail; Manufacturer: Texas Instruments; PackageTopMarking: NSUZXYTTE#*LMZ23610; PowerWise: N; RoHS: Y; PinCount: 11; PackageDescription: TO-PMOD, 15 x 15 x 5.9 mm Body, 11 Lead, 1.27 mm Pitch, Surface Mount; PackageReference: NDY0011A
U22 = CMP-0069-02076-2: 3A SIMPLE SWITCHER® Power Module with 36V Maximum Input Voltage, 7 pin TO-PMOD, 250 Reel; Manufacturer: Texas Instruments; PowerWise: N; PackageTopMarking: NSUZXYTTE#*LMZ23603; ComponentLink1URL: http://www.ti.com/general/docs/lit/getliterature.tsp?genericPartNumber=LMZ23603&fileType=pdf; RoHS: Y; CompType: Switcher; PackageReference: NDW0007A; PackageDescription: TO-PMOD-7, 10.16 x 9.85 x 4.57 mm Body, 7 Lead, 1.27mm Pitch, Surface Mount; ComponentLink1Description: Datasheet URL; PinCount: 7
U25 = REG_LDO_TPS7A4701RGWR: REG - LINEAR POS ADJ 1A - 20VQFN; Manufacturer #1: Texas Instruments; GRAMS Lib Spec: 2.8; Magnetic Material: Unknown; Polarized: Yes; Value: 1.4 à 34V; Voltage rating: 35V max; Assembly Type: SMD; CreatedBy/Date: L-P Gauthier / 2018-05-29; Current Rating: 1A; Manufacturer #2: TBD; Part Number #1: TPS7A4701RGWR; Part Number #2: TBD; Package: 20-VQFN Exposed Pad; Power Max: *; Tolerance: -; Supplier 1: Digi-Key; Supplier Part Number 1: 296-37224-1-ND; VerifiedBy: Caroline Paulin - 28 sept 2018; Temperature: -40°C ~ 125°C; HelpURL: http://www.ti.com/lit/ds/symlink/tps7a47.pdf; Cryo: UNKNOWN

## Sheet S7CAS-PLEIADES-CARTE-MERE_P01_CLOCK.SchDoc
size Tabloid; DocumentNumber: 4; SheetNumber: 4; SheetTotal: 17; Sheet_Name: CLOCK; Size: 11x17
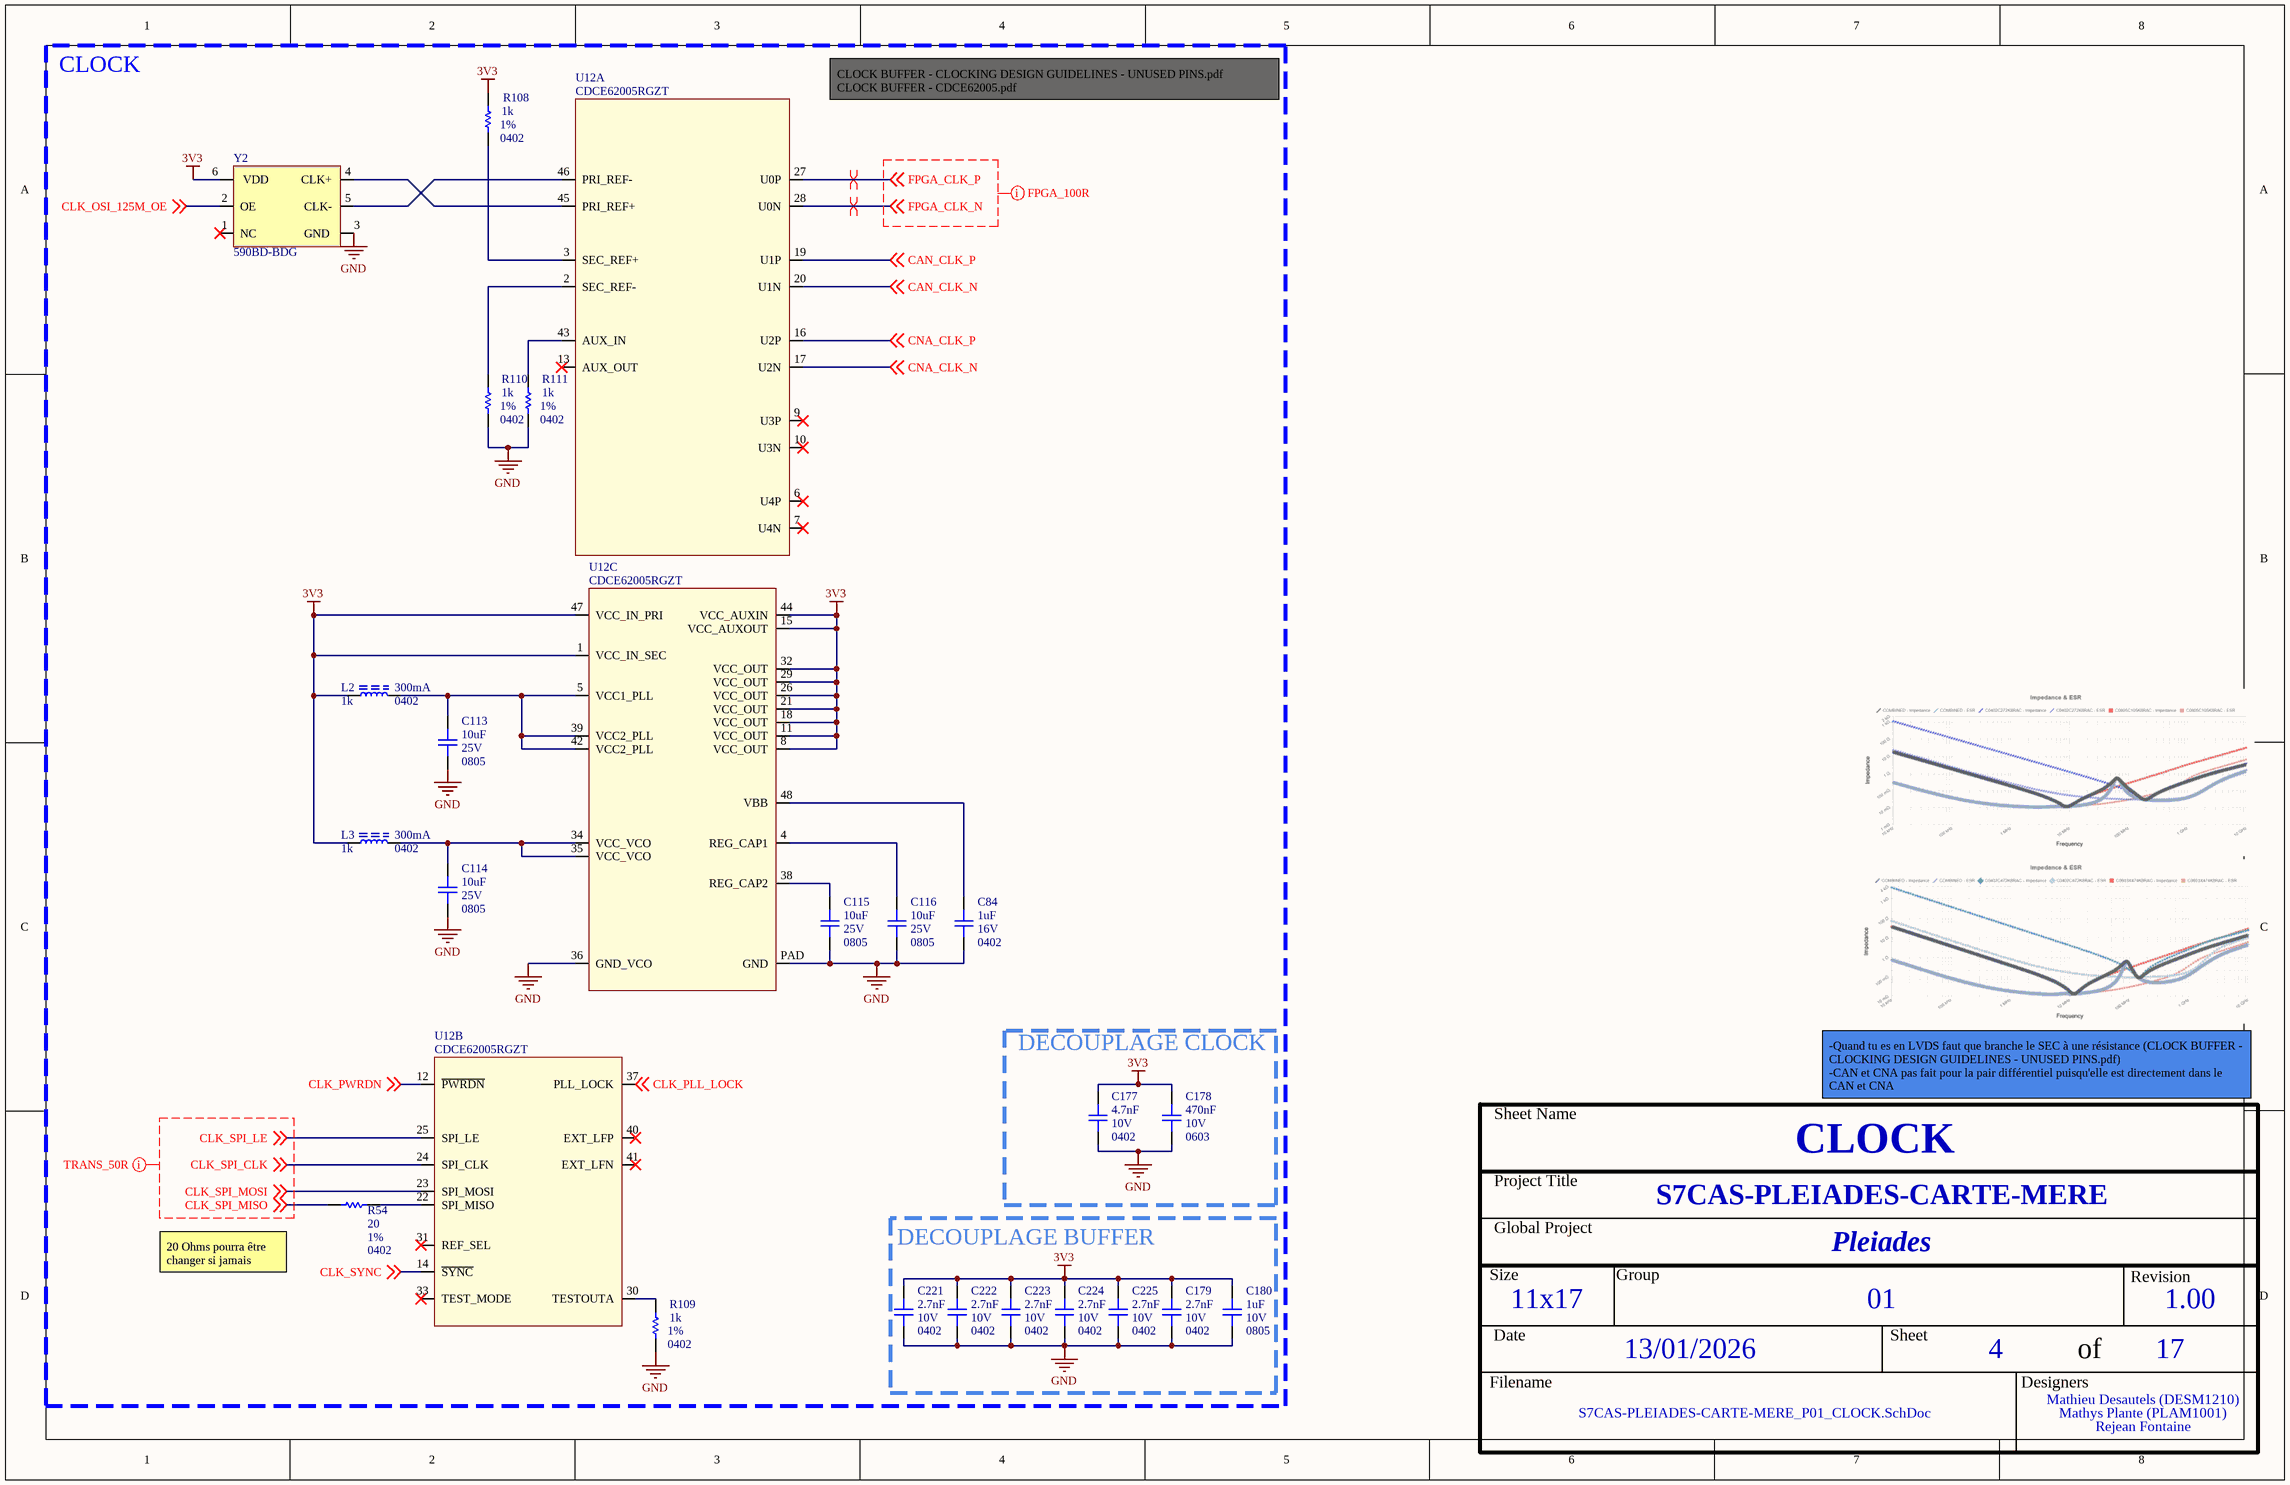
[diagram p3: S7CAS-PLEIADES-CARTE-MERE_P01_CLOCK.SchDoc]

### Parts
C84  value 1uF  Voltage: 16V  Package: 0402  [CAP_0402]  (hidden comment: CAP - 0402)
C113  value 10uF  Voltage: 25V  Package: 0805  [CAP_0805]  (hidden comment: CAP - 0805)
C114  value 10uF  Voltage: 25V  Package: 0805  [CAP_0805]  (hidden comment: CAP - 0805)
C115  value 10uF  Voltage: 25V  Package: 0805  [CAP_0805]  (hidden comment: CAP - 0805)
C116  value 10uF  Voltage: 25V  Package: 0805  [CAP_0805]  (hidden comment: CAP - 0805)
C177  value 4.7nF  Voltage: 10V  Package: 0402  [CAP_0402]  (hidden comment: CAP - 0402)
C178  value 470nF  Voltage: 10V  Package: 0603  [CAP_0603]  (hidden comment: CAP - 0603)
C179  value 2.7nF  Voltage: 10V  Package: 0402  [CAP_0402]  (hidden comment: CAP - 0402)
C180  value 1uF  Voltage: 10V  Package: 0805  [CAP_0805]  (hidden comment: CAP - 0805)
C221  value 2.7nF  Voltage: 10V  Package: 0402  [CAP_0402]  (hidden comment: CAP - 0402)
C222  value 2.7nF  Voltage: 10V  Package: 0402  [CAP_0402]  (hidden comment: CAP - 0402)
C223  value 2.7nF  Voltage: 10V  Package: 0402  [CAP_0402]  (hidden comment: CAP - 0402)
C224  value 2.7nF  Voltage: 10V  Package: 0402  [CAP_0402]  (hidden comment: CAP - 0402)
C225  value 2.7nF  Voltage: 10V  Package: 0402  [CAP_0402]  (hidden comment: CAP - 0402)
L2  value 1k  Current: 300mA  Package: 0402  [FER_0402]  (hidden comment: FER - 0402)
L3  value 1k  Current: 300mA  Package: 0402  [FER_0402]  (hidden comment: FER - 0402)
R54  value 20  Package: 0402  Precision: 1%  [RES_0402]  (hidden comment: RES - 0402)
R108  value 1k  Package: 0402  Precision: 1%  [RES_0402]  (hidden comment: RES - 0402)
R109  value 1k  Package: 0402  Precision: 1%  [RES_0402]  (hidden comment: RES - 0402)
R110  value 1k  Package: 0402  Precision: 1%  [RES_0402]  (hidden comment: RES - 0402)
R111  value 1k  Package: 0402  Precision: 1%  [RES_0402]  (hidden comment: RES - 0402)
U12  CDCE62005RGZT  [TIM_CDCE62005RGZT]  (parts A,B,C of 3)
Y2  590BD-BDG  [OSC_590BD-BDG]

### Blocks framed on the sheet
CLOCK: C84 C113-C116 L2 L3 R54 R108-R111 U12 Y2
DECOUPLAGE CLOCK: C177 C178
DECOUPLAGE BUFFER: C179 C180 C221-C225

### Nets
3V3: C177.2 C178.2 C179.2 C180.2 C221.2 C222.2 C223.2 C224.2 C225.2 L2.2 L3.2 R108.2 U12.1(VCC_IN_SEC) U12.8(VCC_OUT) U12.11(VCC_OUT) U12.15(VCC_AUXOUT) U12.18(VCC_OUT) U12.21(VCC_OUT) U12.26(VCC_OUT) U12.29(VCC_OUT) U12.32(VCC_OUT) U12.44(VCC_AUXIN) U12.47(VCC_IN_PRI) Y2.6(VDD)  [project net VDD_3V3]
GND: C84.1 C113.1 C114.1 C115.1 C116.1 C177.1 C178.1 C179.1 C180.1 C221.1 C222.1 C223.1 C224.1 C225.1 R109.1 R110.1 R111.1 U12.36(GND_VCO) U12.PAD(GND) Y2.3(GND)
CAN_CLK_N: U12.20(U1N) ; off-sheet CAN_CLK_N
CAN_CLK_P: U12.19(U1P) ; off-sheet CAN_CLK_P
CLK_OSI_125M_OE: Y2.2(OE) ; off-sheet CLK_OSI_125M_OE
CLK_PLL_LOCK: U12.37(PLL_LOCK) ; off-sheet CLK_PLL_LOCK
CLK_PWRDN: U12.12(~{PWRDN}) ; off-sheet CLK_PWRDN
CLK_SPI_CLK: U12.24(SPI_CLK) ; off-sheet CLK_SPI_CLK
CLK_SPI_LE: U12.25(SPI_LE) ; off-sheet CLK_SPI_LE
CLK_SPI_MISO: R54.2 ; off-sheet CLK_SPI_MISO
CLK_SPI_MOSI: U12.23(SPI_MOSI) ; off-sheet CLK_SPI_MOSI
CLK_SYNC: U12.14(~{SYNC}) ; off-sheet CLK_SYNC
CNA_CLK_N: U12.17(U2N) ; off-sheet CNA_CLK_N
CNA_CLK_P: U12.16(U2P) ; off-sheet CNA_CLK_P
FPGA_CLK_N: U12.28(U0N) ; off-sheet FPGA_CLK_N
FPGA_CLK_P: U12.27(U0P) ; off-sheet FPGA_CLK_P
NetC84_2: C84.2 U12.48(VBB)
NetC113_2: C113.2 L2.1 U12.5(VCC1_PLL) U12.39(VCC2_PLL) U12.42(VCC2_PLL)
NetC114_2: C114.2 L3.1 U12.34(VCC_VCO) U12.35(VCC_VCO)
NetC115_2: C115.2 U12.38(REG_CAP2)
NetC116_2: C116.2 U12.4(REG_CAP1)
NetR54_1: R54.1 U12.22(SPI_MISO)
NetR108_1: R108.1 U12.3(SEC_REF+)
NetR109_2: R109.2 U12.30(TESTOUTA)
NetR110_2: R110.2 U12.2(SEC_REF-)
NetR111_2: R111.2 U12.43(AUX_IN)
NetU12_45: U12.45(PRI_REF+) Y2.4(CLK+)
NetU12_46: U12.46(PRI_REF-) Y2.5(CLK-)

Not connected (* = marked no-connect by the designer): U12 6(U4P)* 7(U4N)* 9(U3P)* 10(U3N)* 13(AUX_OUT)* 31(REF_SEL)* 33(TEST_MODE)* 40(EXT_LFP)* 41(EXT_LFN)*; Y2 1(NC)*

### Layout directives
net class FPGA_100R: FPGA_CLK_N, FPGA_CLK_P
differential pair: FPGA_CLK_N, FPGA_CLK_P
net class TRANS_50R: CLK_SPI_CLK, CLK_SPI_LE, CLK_SPI_MISO, CLK_SPI_MOSI

### Notes on the sheet
- CLOCK BUFFER - CLOCKING DESIGN GUIDELINES - UNUSED PINS.pdf
  CLOCK BUFFER - CDCE62005.pdf
- -Quand tu es en LVDS faut que branche le SEC à une résistance (CLOCK BUFFER - CLOCKING DESIGN GUIDELINES - UNUSED PINS.pdf)
  -CAN et CNA pas fait pour la pair différentiel puisqu'elle est directement dans le CAN et CNA
- 20 Ohms pourra être changer si jamais
- Sheet Name
- Project Title
- Global Project
- Size
- Group
- Revision
- Date
- Sheet
- of
- Filename
- Designers

### Library data of the parts
C84 = CAP - 0402: as C111 on sheet S7CAS-PLEIADES-CARTE-MERE_P01_ALIM; Current: *; CreatedBy: Jonathan Bouchard; Power: *; Precision: 10%
C113-C116 = CAP - 0805: as C36 on sheet S7CAS-PLEIADES-CARTE-MERE_P01_ALIM; Current: *; CreatedBy: Jonathan Bouchard; Power: *; Precision: 10%; Part Number #1: CL21A106KAYNNNE
C177 = CAP - 0402: Mfg Part Number: C0402C472K8RAC; Precision: 10%; Current: *; CreatedBy: Jonathan Bouchard; Power: *
C178 = CAP - 0603: Mfg Part Number: C0603X474K8RAC; Precision: 10%; Current: *; CreatedBy: Jonathan Bouchard; Power: *
C179 C221-C225 = CAP - 0402: Mfg Part Number: C0402C272K8RAC; Precision: 10%; Current: *; CreatedBy: Jonathan Bouchard; Power: *
C180 = CAP - 0805: Mfg Part Number: C0805C105K8RAC; Precision: 10%; Current: *; CreatedBy: Jonathan Bouchard; Power: *
L2 L3 = FER - 0402: 1 kOhms @ 100 MHz 1 Ferrite Bead 0402 (1005 Metric) 300mA 650mOhm; Mfg Part Number: BLM15AG102SN1D; Mfg: Murata Electronics; Voltage: *; CreatedBy: Jonathan Bouchard; Power: *; Precision: *; Part Number #1: BLM15AG102SN1D
R54 = RES - 0402: 20 Ohms ±1% 0.063W, 1/16W Chip Resistor 0402 (1005 Metric) Moisture Resistant Thick Film; Mfg Part Number: RC0402FR-0720RL; Voltage: 75V; Current: *; CreatedBy: Jonathan Bouchard; Power: 1/16W; Part Number #1: RC0402FR-0720RL
R108-R111 = RES - 0402: 1 kOhms ±1% 0.1W, 1/10W Chip Resistor 0402 (1005 Metric) Automotive AEC-Q200 Thick Film; Mfg Part Number: ERJ-2RKF1001X; Voltage: 50V; Mfg: Panasonic Electronic Components; Current: *; CreatedBy: Jonathan Bouchard; Power: 1/10W; Part Number #1: ERJ-2RKF1001X
U12 = TIM_CDCE62005RGZT: TIM - CLK SYNTH JITTER CLEANER 3:5 - QFN-48; Voltage: 3 V ~ 3.6 V; Mfg: Texas Instruments; Current: *; Power: *; Mfg Part Number: CDCE62005RGZT; HelpURL: http://www.ti.com/lit/ds/symlink/cdce62005.pdf; CreatedBy: Jonathan Bouchard; Temperature: -40°C ~ 85°C; Value: *; Precision: *; Package: QFN-48; Supplier 1: Digikey; Supplier Part Number 1: 296-23947-1-ND
Y2 = OSC_590BD-BDG: TIM - OSC PROG 125MHz ~ 214.999MHz LVDS 3.3V 7PPM EN/DS - 6-SMD; Manufacturer #1: Silicon Labs; Current Rating: 100 mA (supply); Voltage rating: 3.3V (supply); Polarized: Yes; Value: ±7ppm (freq Stability), ±20ppm (freq stability total); Magnetic Material: UNKNOWN; GRAMS Lib Spec: 2.8; Manufacturer #2: *; Power Max: *; Part Number #1: 590BD-BDG; Part Number #2: *; HelpURL: https://www.silabs.com/documents/public/data-sheets/Si590-591.pdf; Supplier 1: Digi-Key; Supplier Part Number 1: 590BD-BDG-ND; Temperature: -40°C ~ 85°C; Package: 6-SMD; CreatedBy/Date: from 590BD-CDG; Tolerance: *; VerifiedBy: Caroline Paulin / 3/10/2019; Cryo: UNKNOWN; Mfg Part Number: 590BD-BDG

## Sheet S7CAS-PLEIADES-CARTE-MERE_P01_ETHERNET.SchDoc
size Tabloid; DocumentNumber: 5; SheetNumber: 5; SheetTotal: 17; Sheet_Name: ETHERNET; Size: 11x17
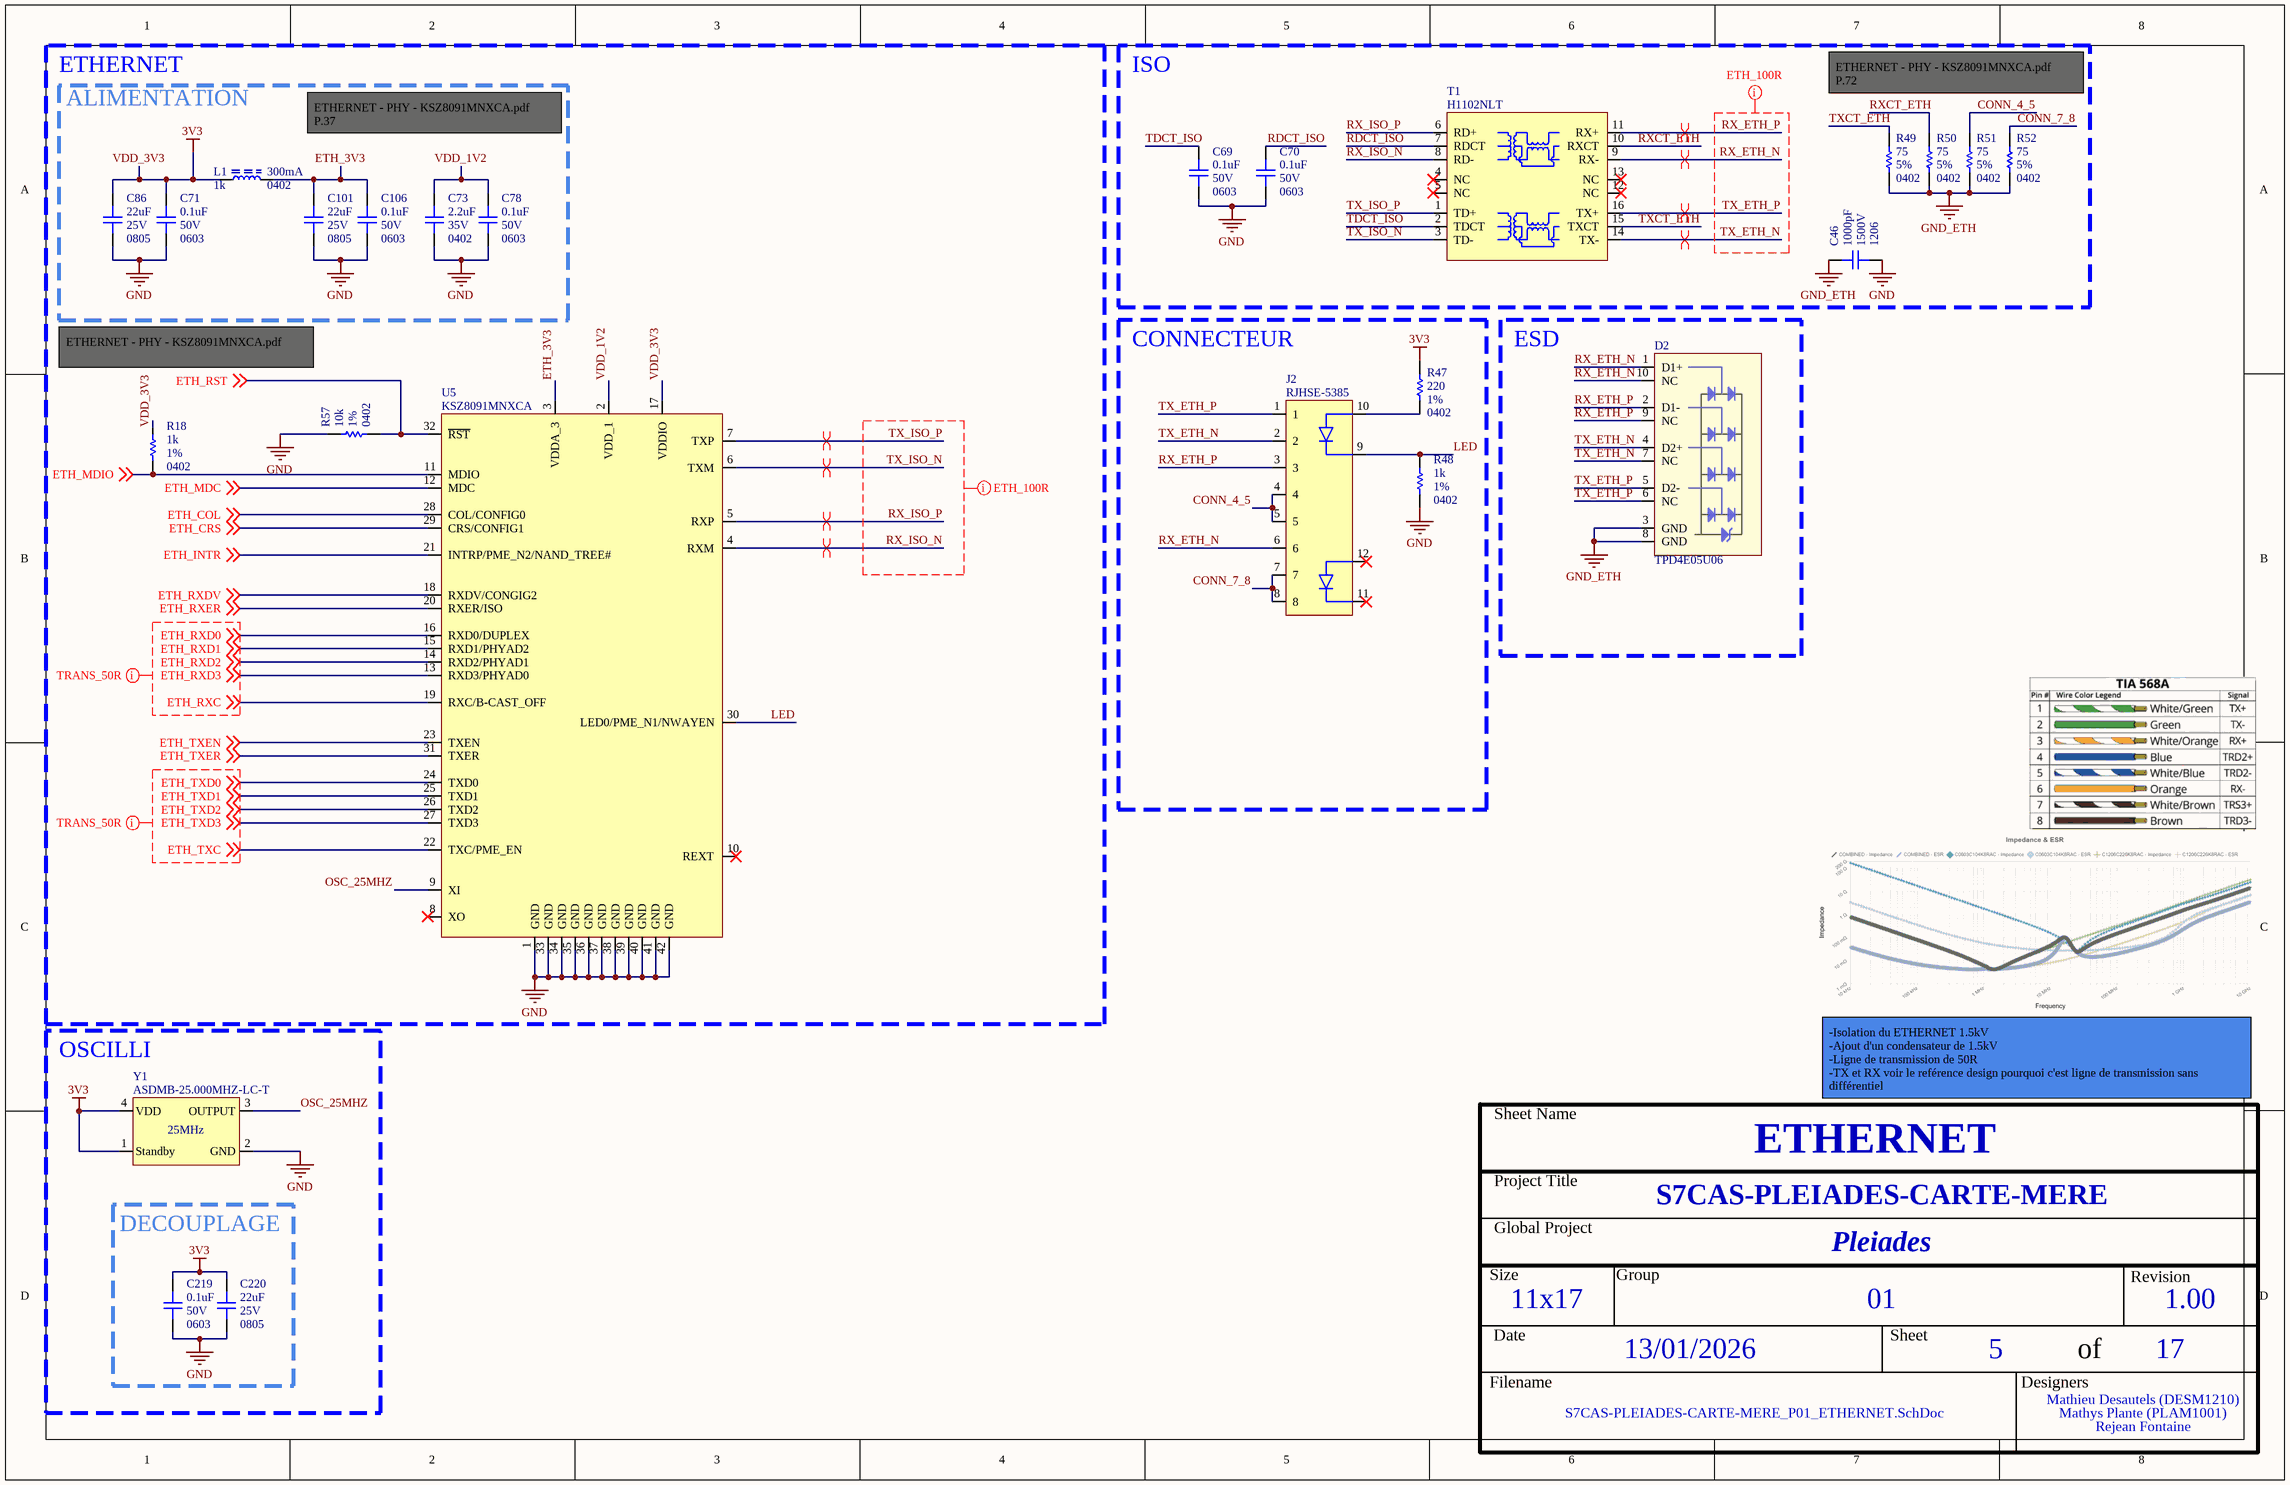
[diagram p4: S7CAS-PLEIADES-CARTE-MERE_P01_ETHERNET.SchDoc]

### Parts
C46  value 1000pF  Voltage: 1500V  Package: 1206  [CAP_1206]  (hidden comment: CAP - 1206)
C69  value 0.1uF  Voltage: 50V  Package: 0603  [CAP_0603]  (hidden comment: CAP - 0603)
C70  value 0.1uF  Voltage: 50V  Package: 0603  [CAP_0603]  (hidden comment: CAP - 0603)
C71  value 0.1uF  Voltage: 50V  Package: 0603  [CAP_0603]  (hidden comment: CAP - 0603)
C73  value 2.2uF  Voltage: 35V  Package: 0402  [CAP_0402]  (hidden comment: CAP - 0402)
C78  value 0.1uF  Voltage: 50V  Package: 0603  [CAP_0603]  (hidden comment: CAP - 0603)
C86  value 22uF  Voltage: 25V  Package: 0805  [CAP_0805]  (hidden comment: CAP - 0805)
C101  value 22uF  Voltage: 25V  Package: 0805  [CAP_0805]  (hidden comment: CAP - 0805)
C106  value 0.1uF  Voltage: 50V  Package: 0603  [CAP_0603]  (hidden comment: CAP - 0603)
C219  value 0.1uF  Voltage: 50V  Package: 0603  [CAP_0603]  (hidden comment: CAP - 0603)
C220  value 22uF  Voltage: 25V  Package: 0805  [CAP_0805]  (hidden comment: CAP - 0805)
D2  TPD4E05U06  [TVS_DATA_TPD4E05U06]
J2  RJHSE-5385  [CONN_ETHERNET_RJHSE-5385]
L1  value 1k  Current: 300mA  Package: 0402  [FER_0402]  (hidden comment: FER - 0402)
R18  value 1k  Package: 0402  Precision: 1%  [RES_0402]  (hidden comment: RES - 0402)
R47  value 220  Package: 0402  Precision: 1%  [RES_0402]  (hidden comment: RES - 0402)
R48  value 1k  Package: 0402  Precision: 1%  [RES_0402]  (hidden comment: RES - 0402)
R49  value 75  Package: 0402  Precision: 5%  [RES_0402]  (hidden comment: RES - 0402)
R50  value 75  Package: 0402  Precision: 5%  [RES_0402]  (hidden comment: RES - 0402)
R51  value 75  Package: 0402  Precision: 5%  [RES_0402]  (hidden comment: RES - 0402)
R52  value 75  Package: 0402  Precision: 5%  [RES_0402]  (hidden comment: RES - 0402)
R57  value 10k  Package: 0402  Precision: 1%  [RES_0402]  (hidden comment: RES - 0402)
T1  H1102NLT  [TRANSFO_H1102NLT]
U5  KSZ8091MNXCA  [COM_ETH_PHY_KSZ8091MNXCA]
Y1  ASDMB-25.000MHZ-LC-T  [OSC_ASDMB-25.000MHZ-LC-T]

### Blocks framed on the sheet
ISO: C46 C69 C70 R49-R52 T1
CONNECTEUR: J2 R47 R48
ESD: D2
OSCILLI: Y1
DECOUPLAGE: C219 C220

### Nets
GND: C46.1 C69.1 C70.1 C71.1 C73.1 C78.1 C86.1 C101.1 C106.1 C219.1 C220.1 R48.1 R57.1 U5.1(GND) U5.33(GND) U5.34(GND) U5.35(GND) U5.36(GND) U5.37(GND) U5.38(GND) U5.39(GND) U5.40(GND) U5.41(GND) U5.42(GND) Y1.2(GND)
GND_ETH: C46.2 D2.3(GND) D2.8(GND) R49.1 R50.1 R51.1 R52.1
VDD_3V3: C71.2 C86.2 C219.2 C220.2 L1.2 R18.2 R47.2 U5.17(VDDIO) Y1.1(Standby) Y1.4(VDD)  [also labelled 3V3]
CONN_4_5: J2.4 J2.5 R51.2
CONN_7_8: J2.7 J2.8 R52.2
ETH_3V3: C101.2 C106.2 L1.1 U5.3(VDDA_3)
ETH_COL: U5.28(COL/CONFIG0) ; off-sheet ETH_COL
ETH_CRS: U5.29(CRS/CONFIG1) ; off-sheet ETH_CRS
ETH_INTR: U5.21(INTRP/PME_N2/NAND_TREE#) ; off-sheet ETH_INTR
ETH_MDC: U5.12(MDC) ; off-sheet ETH_MDC
ETH_MDIO: R18.1 U5.11(MDIO) ; off-sheet ETH_MDIO
ETH_RST: R57.2 U5.32(~{RST}) ; off-sheet ETH_RST
ETH_RXC: U5.19(RXC/B-CAST_OFF) ; off-sheet ETH_RXC
ETH_RXD0: U5.16(RXD0/DUPLEX) ; off-sheet ETH_RXD0
ETH_RXD1: U5.15(RXD1/PHYAD2) ; off-sheet ETH_RXD1
ETH_RXD2: U5.14(RXD2/PHYAD1) ; off-sheet ETH_RXD2
ETH_RXD3: U5.13(RXD3/PHYAD0) ; off-sheet ETH_RXD3
ETH_RXDV: U5.18(RXDV/CONGIG2) ; off-sheet ETH_RXDV
ETH_RXER: U5.20(RXER/ISO) ; off-sheet ETH_RXER
ETH_TXC: U5.22(TXC/PME_EN) ; off-sheet ETH_TXC
ETH_TXD0: U5.24(TXD0) ; off-sheet ETH_TXD0
ETH_TXD1: U5.25(TXD1) ; off-sheet ETH_TXD1
ETH_TXD2: U5.26(TXD2) ; off-sheet ETH_TXD2
ETH_TXD3: U5.27(TXD3) ; off-sheet ETH_TXD3
ETH_TXEN: U5.23(TXEN) ; off-sheet ETH_TXEN
ETH_TXER: U5.31(TXER) ; off-sheet ETH_TXER
LED: J2.9(LED1_K) R48.2 U5.30(LED0/PME_N1/NWAYEN)
OSC_25MHZ: U5.9(XI) Y1.3(OUTPUT)
RDCT_ISO: C70.2 T1.7(RDCT)
RX_ETH_N: D2.1(D1+) D2.10(NC) J2.6 T1.9(RX-)
RX_ETH_P: D2.2(D1-) D2.9(NC) J2.3 T1.11(RX+)
RX_ISO_N: T1.8(RD-) U5.4(RXM)
RX_ISO_P: T1.6(RD+) U5.5(RXP)
RXCT_ETH: R50.2 T1.10(RXCT)
TDCT_ISO: C69.2 T1.2(TDCT)
TX_ETH_N: D2.4(D2+) D2.7(NC) J2.2 T1.14(TX-)
TX_ETH_P: D2.5(D2-) D2.6(NC) J2.1 T1.16(TX+)
TX_ISO_N: T1.3(TD-) U5.6(TXM)
TX_ISO_P: T1.1(TD+) U5.7(TXP)
TXCT_ETH: R49.2 T1.15(TXCT)
VDD_1V2: C73.2 C78.2 U5.2(VDD_1)
NetJ2_10: J2.10(LED1_A) R47.1

Not connected (* = marked no-connect by the designer): J2 11(LED2_K)* 12(LED2_A)*; T1 4(NC)* 5(NC)* 12(NC)* 13(NC)*; U5 8(XO)* 10(REXT)*

### Layout directives
net class ETH_100R: RX_ETH_N, RX_ETH_P, RX_ISO_N, RX_ISO_P, TX_ETH_N, TX_ETH_P, TX_ISO_N, TX_ISO_P
net class TRANS_50R; net class ETH_TRANS_50R: ETH_RXC, ETH_RXD0, ETH_RXD1, ETH_RXD2, ETH_RXD3, ETH_TXC, ETH_TXD0, ETH_TXD1, ETH_TXD2, ETH_TXD3
differential pair: RX_ETH_N, RX_ETH_P, RX_ISO_N, RX_ISO_P, TX_ETH_N, TX_ETH_P, TX_ISO_N, TX_ISO_P

### Notes on the sheet
- ETHERNET
- ETHERNET - PHY - KSZ8091MNXCA.pdf
  P.72
- ALIMENTATION
- ETHERNET - PHY - KSZ8091MNXCA.pdf
  P.37
- ETHERNET - PHY - KSZ8091MNXCA.pdf
- -Isolation du ETHERNET 1.5kV
  -Ajout d'un condensateur de 1.5kV
  -Ligne de transmission de 50R
  -TX et RX voir le reférence design pourquoi c'est ligne de transmission sans différentiel
- Sheet Name
- Project Title
- Global Project
- Size
- Group
- Revision
- Date
- Sheet
- of
- Filename
- Designers

### Library data of the parts
C46 = CAP - 1206: 1000 pF ±5% 1500V (1.5kV) Ceramic Capacitor C0G, NP0 1206 (3216 Metric); Mfg Part Number: VJ1206A102JXRAT5Z; Mfg: Vishay Vitramon; Current: *; CreatedBy: Jonathan Bouchard; Power: *; Precision: 5%; Part Number #1: VJ1206A102JXRAT5Z
C69-C71 C78 C106 C219 = CAP - 0603: 0.1 µF ±10% 50V Ceramic Capacitor X7R 0603 (1608 Metric); Mfg Part Number: C0603C104K5RACTU; Mfg: KEMET; Current: *; CreatedBy: Jonathan Bouchard; Power: *; Precision: 10%
C73 = CAP - 0402: as C89 on sheet S7CAS-PLEIADES-CARTE-MERE_P01_ALIM; Current: *; CreatedBy: Jonathan Bouchard; Power: *; Precision: 10%
C86 C101 C220 = CAP - 0805: as C41 on sheet S7CAS-PLEIADES-CARTE-MERE_P01_ALIM; Current: *; CreatedBy: Jonathan Bouchard; Power: *; Precision: 20%
D2 = TVS_DATA_TPD4E05U06: TVS - TVS DIODE 5.5VWM 14VC - 10SON; Manufacturer #1: Texas Instruments; Part Number #1: TPD4E05U06DQAR; Current Rating: 2.5A (8/20µs); Power Max: 40 W (peak); Value: 4 unidirectionnal channels; Voltage rating: 6V (Breakdown); Polarized: YES; Magnetic Material: UNKNOWN; GRAMS Lib Spec: 2.8; Manufacturer #2: *; Part Number #2: *; HelpURL: http://www.ti.com/lit/ds/symlink/tpd4e05u06.pdf; Supplier 1: Digi-Key; Supplier Part Number 1: 296-35765-1-ND; Temperature: -40°C ~ 125°C; Package: 10-USON; CreatedBy/Date: Olivier Bernard / 12/3/2018; Tolerance: *; VerifiedBy: Caroline Paulin / 4 juillet 2018; Cryo: UNKNOWN; Mfg Part Number: TPD4E05U06DQAR
J2 = CONN_ETHERNET_RJHSE-5385: CONN - MOD JACK RJ45 R/A ETHERNET - TH; Mfg: Amphenol; Voltage: *; Current: *; Power: *; Mfg Part Number: RJHSE-5385; HelpURL: https://www.amphenolcanada.com/ProductSearch/drawings/AC/RJHSE538X.pdf; CreatedBy: Jonathan Bouchard; Temperature: -55°C ~ 85°C; Value: *; Precision: *; Package: TH-12; Supplier 1: Digikey; Supplier Part Number 1: RJHSE-5385-ND; Part Number #1: RJHSE-5385
L1 = FER - 0402: as L2 on sheet S7CAS-PLEIADES-CARTE-MERE_P01_CLOCK; Voltage: *; CreatedBy: Jonathan Bouchard; Power: *; Precision: *; Part Number #1: BLM15AG102SN1D
R18 R48 = RES - 0402: as R108 on sheet S7CAS-PLEIADES-CARTE-MERE_P01_CLOCK; Current: *; CreatedBy: Jonathan Bouchard; Power: 1/10W; Part Number #1: ERJ-2RKF1001X
R47 = RES - 0402: 220 Ohms ±1% 0.1W, 1/10W Chip Resistor 0402 (1005 Metric) Automotive AEC-Q200 Thick Film220; Mfg Part Number: ERJ-2RKF2200X; Voltage: 50V; Mfg: Panasonic Electronic Components; Current: *; CreatedBy: Jonathan Bouchard; Power: 1/10W; Part Number #1: ERJ-2RKF2200X
R49-R52 = RES - 0402: 75 Ohms ±5% 0.063W, 1/16W Chip Resistor 0402 (1005 Metric) Moisture Resistant Thick Film; Mfg Part Number: RC0402JR-0775RL; Voltage: 50V; Mfg: YAGEO; Current: *; CreatedBy: Jonathan Bouchard; Power: 1/16W; Part Number #1: RC0402JR-0775RL
R57 = RES - 0402: as R53 on sheet S7CAS-PLEIADES-CARTE-MERE_P01_ALIM; Current: *; CreatedBy: Jonathan Bouchard; Power: 1/16W; Part Number #1: RMCF0402FT10K0
T1 = TRANSFO_H1102NLT: TRANSFO - ETHERNET 10/100B-TX - SMD-16; Mfg: Pulse Eng.; Value: 1:1 (350uH); Voltage: *; Current: *; Power: *; Mfg Part Number: H1102NLT; HelpURL: http://media.digikey.com/pdf/Data%20Sheets/Pulse%20PDFs/10_100BASE-T%20Single%20Port%20SMD%20Magnetics_Rev2008.pdf; CreatedBy: Jonathan Bouchard; Temperature: -40°C to 85°C; Precision: *; Package: SMD-16; Supplier 1: Digikey; Supplier Part Number 1: 553-1532-1-ND; Part Number #1: H1102NLT
U5 = COM_ETH_PHY_KSZ8091MNXCA: COM - ETHERNET PHY 10/100 - QFN-32; Voltage: 1.8V, 2.5V, 3.3V; Mfg: Micrel; Current: *; Power: *; Mfg Part Number: KSZ8091MNXCA; HelpURL: http://ww1.microchip.com/downloads/en/DeviceDoc/00002275A.pdf; CreatedBy: Jonathan Bouchard; Temperature: 0°C ~ 70°C; Value: *; Precision: *; Package: QFN-32; Supplier 1: Digikey; Supplier Part Number 1: 576-4356-ND; Part Number #1: KSZ8091MNXCA
Y1 = OSC_ASDMB-25.000MHZ-LC-T: OSC - 25MHz XO (Standard) LVCMOS - 4-SMD, No Lead; Manufacturer #1: Abracon LLC; Tolerance: ±50ppm; Voltage Rating: 1.8V ~ 3.3V; GRAMS Lib Spec: 2.8; Magnetic Material: Unknown; Polarized: Yes; Value: 25MHz; Current Rating: *; Power Max: *; HelpURL: https://abracon.com/Oscillators/ASDMB.pdf; CreatedBy/Date: Joël Lemay 2019-03-29; VerifiedBy: C. Paulin - 29 mai 2019; Temperature: -40°C ~ +85°C; Package: 4-SMD, No Lead; Manufacturer #2: *; Part Number #2: *; Part Number #1: ASDMB-25.000MHZ-LC-T; Supplier 1: Digi-Key; Supplier Part Number 1: 535-11730-1-ND; Cryo: UNKNOWN; Mfg Part Number: ASDMB-25.000MHZ-LC-T